# EAGLE design YOTSUBA_MC_ver.2.3 (EAGLE 9.6.2)
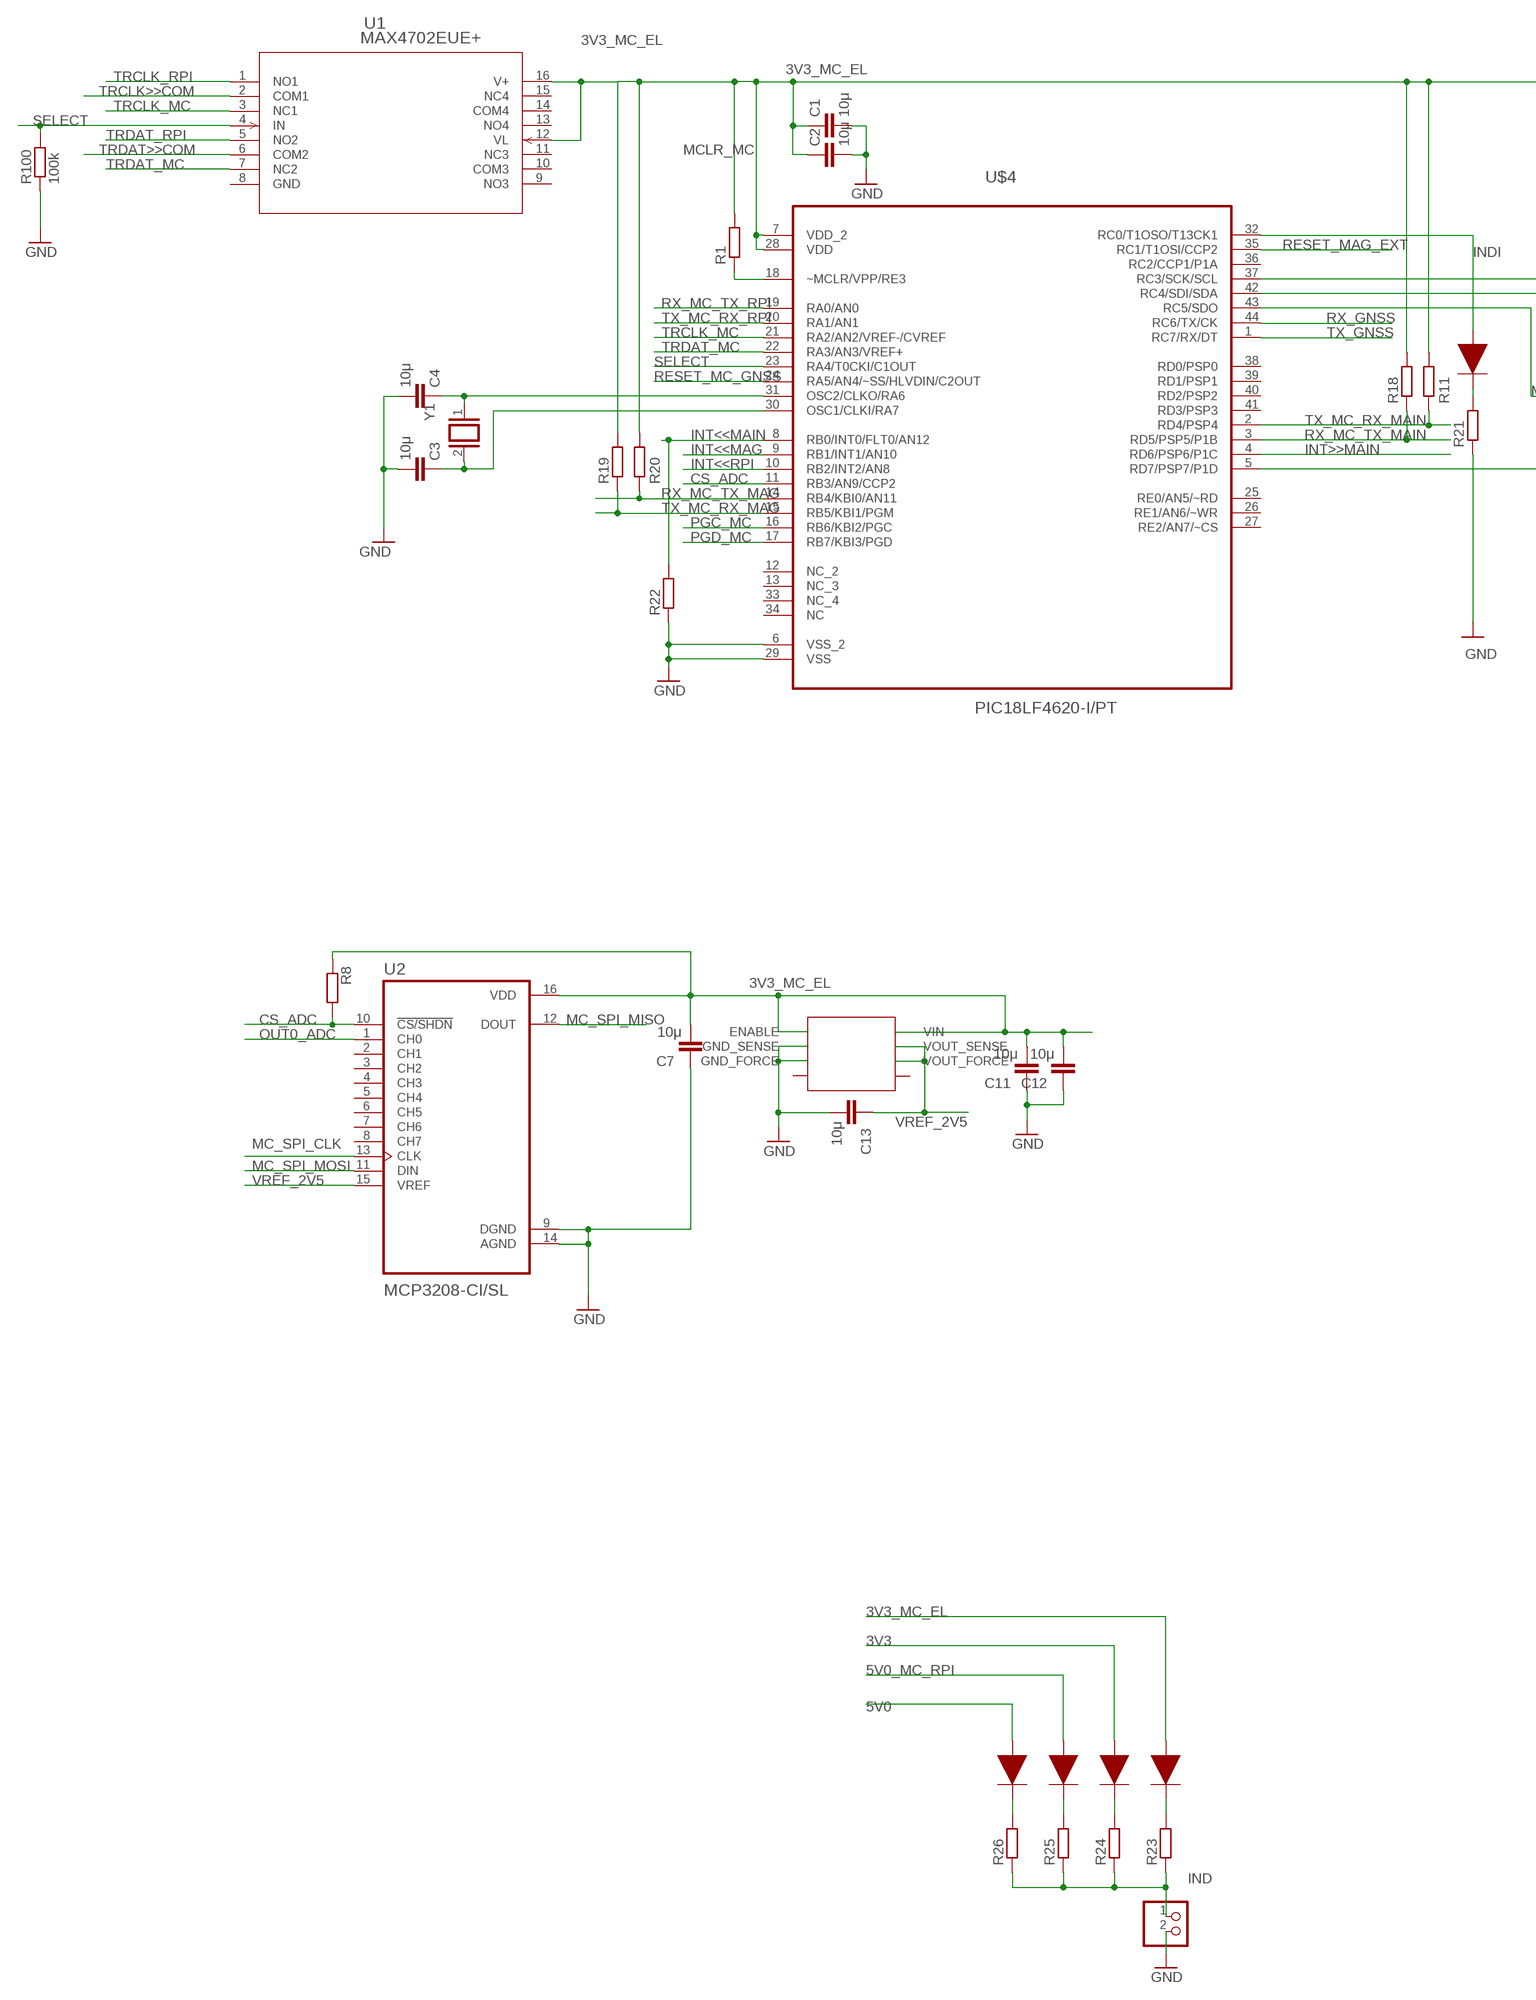
[diagram p0: schematic, sheet 1, part 1 of 2]
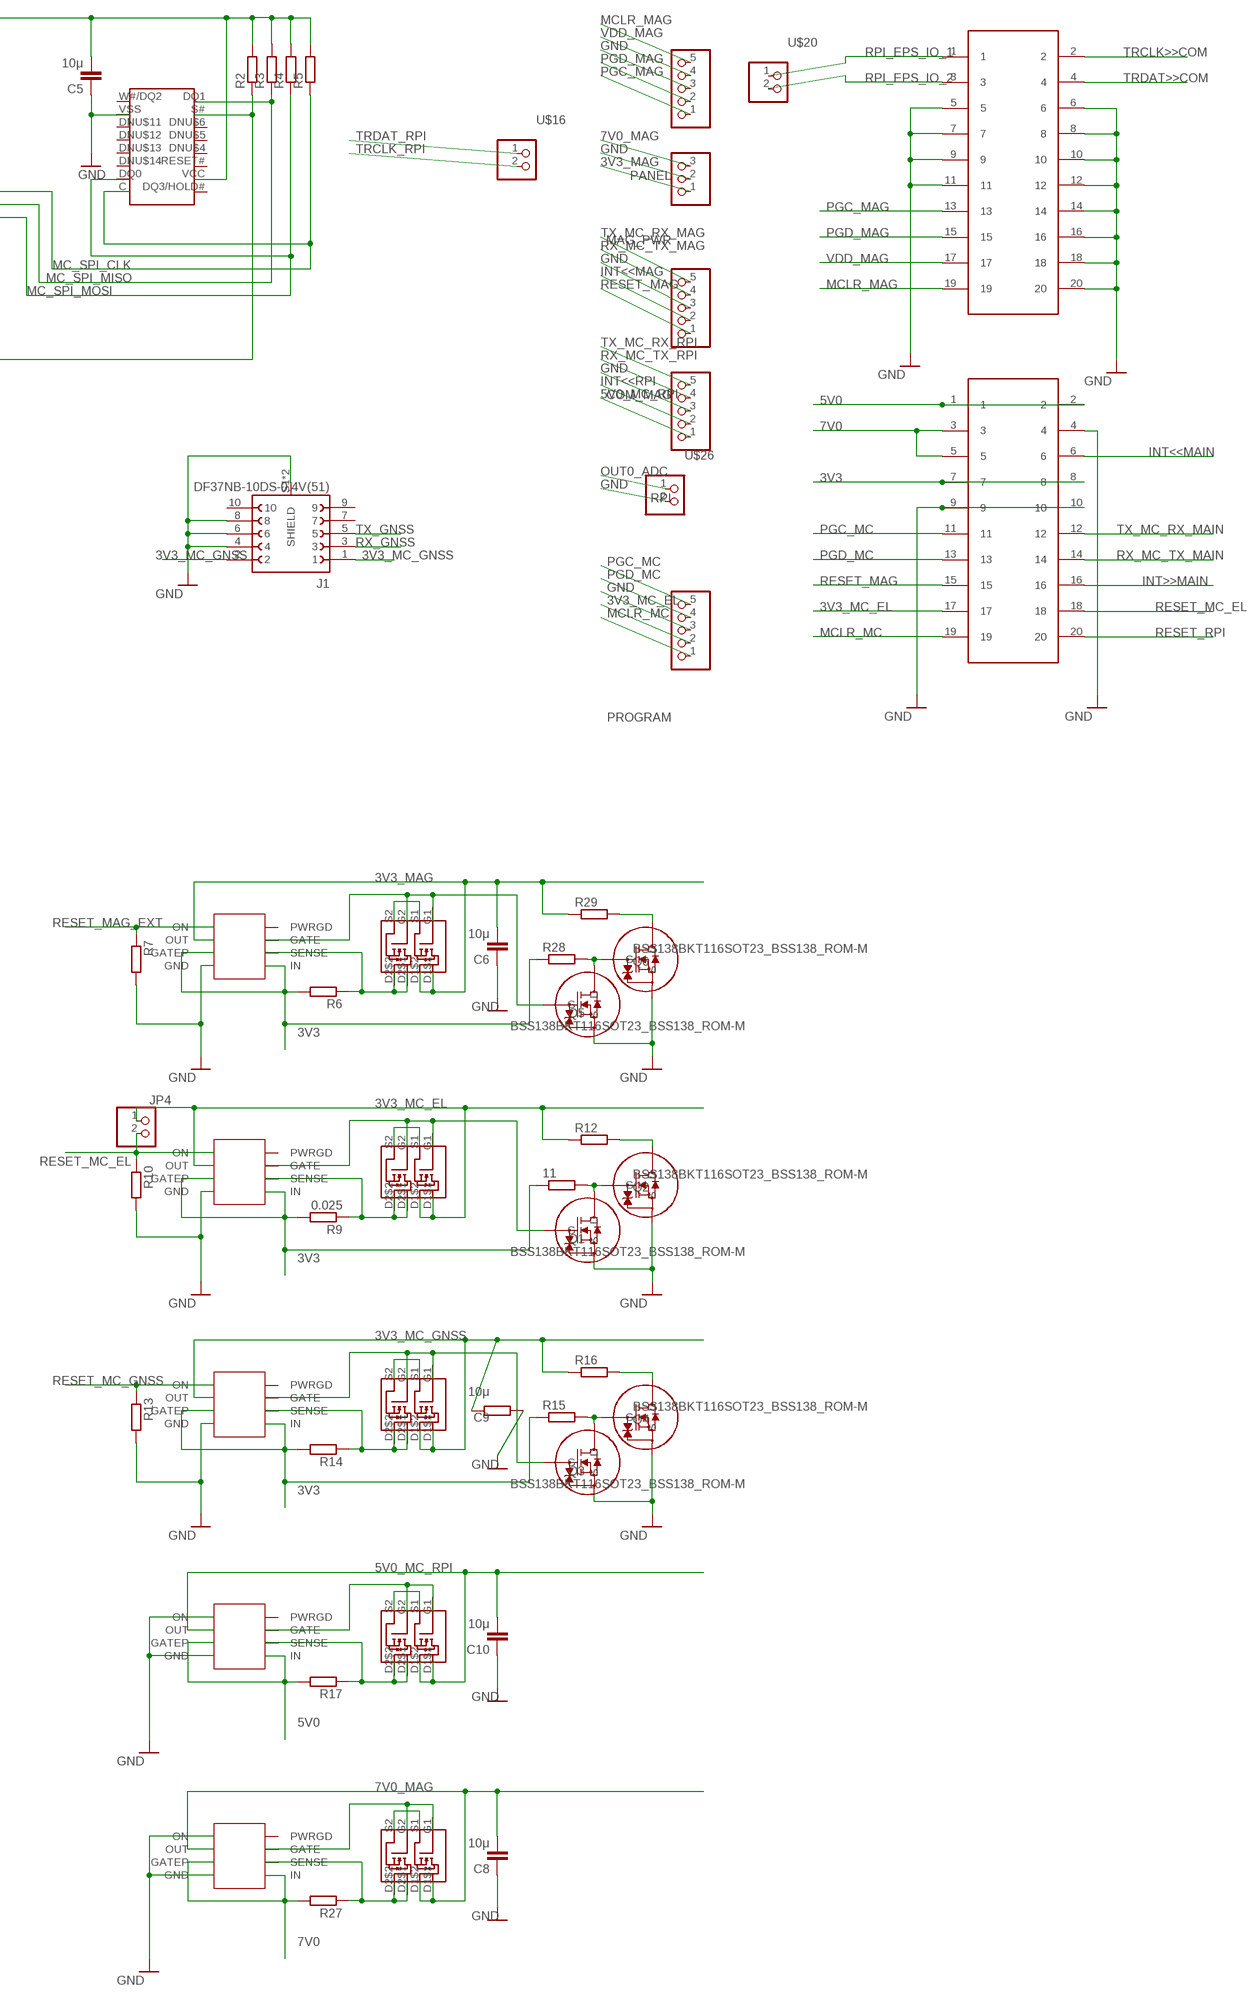
[diagram p1: schematic, sheet 1, part 2 of 2]

## Parts
11  R-EU_R2012  [R2012]
C1  10μ  C-EUC2012  [C2012]
C2  10μ  C-EUC2012  [C2012]
C3  10μ  C-EUC2012  [C2012]
C4  10μ  C-EUC2012  [C2012]
C5  10μ  C-EUC2012  [C2012]
C6  10μ  C-EUC2012  [C2012]
C7  10μ  C-EUC2012  [C2012]
C8  10μ  C-EUC2012  [C2012]
C9  10μ  R-EU_R2012  [R2012]
C10  10μ  C-EUC2012  [C2012]
C11  10μ  C-EUC2012  [C2012]
C12  10μ  C-EUC2012  [C2012]
C13  10μ  C-EUC2012  [C2012]
COM_MAG  PINHD-1X5  [1X05]
IND  PINHD-1X2  [1X02]
J1  DF37NB-10DS-0.4V(51)  [HRS_DF37NB-10DS-0.4V(51)]
JP4  PINHD-1X2  [1X02]
MAG_PWR  PINHD-1X3  [1X03]
PANEL  PINHD-1X5  [1X05]
PROGRAM  PINHD-1X5  [1X05]
Q1  BSS138BKT116SOT23_BSS138_ROM-M  [SOT23_BSS138_ROM-M]
Q2  BSS138BKT116SOT23_BSS138_ROM-M  [SOT23_BSS138_ROM-M]
Q3  BSS138BKT116SOT23_BSS138_ROM-M  [SOT23_BSS138_ROM-M]
Q4  BSS138BKT116SOT23_BSS138_ROM-M  [SOT23_BSS138_ROM-M]
Q5  BSS138BKT116SOT23_BSS138_ROM-M  [SOT23_BSS138_ROM-M]
Q6  BSS138BKT116SOT23_BSS138_ROM-M  [SOT23_BSS138_ROM-M]
R1  R-EU_R2012  [R2012]
R2  R-EU_R2012  [R2012]
R3  R-EU_R2012  [R2012]
R4  R-EU_R2012  [R2012]
R5  R-EU_R2012  [R2012]
R6  R-EU_R2012  [R2012]
R7  R-EU_R2012  [R2012]
R8  R-EU_R2012  [R2012]
R9  0.025  R-EU_R2012  [R2012]
R10  R-EU_R2012  [R2012]
R11  R-EU_R2012  [R2012]
R12  R-EU_R2012  [R2012]
R13  R-EU_R2012  [R2012]
R14  R-EU_R2012  [R2012]
R15  R-EU_R2012  [R2012]
R16  R-EU_R2012  [R2012]
R17  R-EU_R2012  [R2012]
R18  R-EU_R2012  [R2012]
R19  R-EU_R2012  [R2012]
R20  R-EU_R2012  [R2012]
R21  R-EU_R2012  [R2012]
R22  R-EU_R2012  [R2012]
R23  R-EU_R2012  [R2012]
R24  R-EU_R2012  [R2012]
R25  R-EU_R2012  [R2012]
R26  R-EU_R2012  [R2012]
R27  R-EU_R2012  [R2012]
R28  R-EU_R2012  [R2012]
R29  R-EU_R2012  [R2012]
R100  100k  R-EU_R2012  [R2012]
RPI  PINHD-1X5  [1X05]
U1  MAX4702EUE+  [21-0066J_16]
U2  MCP3208-CI/SL  [SOIC127P600X175-16N]
U$1  MT25QL512_16SOP2  [SOIC127P1032X265-16N]
U$2  DMG6898LSD  [SOIC127P600X150-8N]
U$3  LTC4361  [SOP65P280X100-8N]
U$4  PIC18LF4620-I/PT  [QFP80P1200X1200X120-44N]
U$7  DMG6898LSD  [SOIC127P600X150-8N]
U$8  LTC4361  [SOP65P280X100-8N]
U$9  DMG6898LSD  [SOIC127P600X150-8N]
U$10  DMG6898LSD  [SOIC127P600X150-8N]
U$11  LTC4361  [SOP65P280X100-8N]
U$12  LTC4361  [SOP65P280X100-8N]
U$13  DMG6898LSD  [SOIC127P600X150-8N]
U$14  LTC4361  [SOP65P280X100-8N]
U$16  PINHD-1X2  [1X02]
U$17  M50-3001045  [M50-3001045]
U$18  LED_1608  [LED_1608]
U$19  ADR35XX  [SOP65P490X110-8N]
U$20  PINHD-1X2  [1X02]
U$21  LED_1608  [LED_1608]
U$22  M50-3001045  [M50-3001045]
U$23  LED_1608  [LED_1608]
U$24  LED_1608  [LED_1608]
U$25  LED_1608  [LED_1608]
U$26  PINHD-1X2  [1X02]
Y1  HC-49/U-S16000000ABJB  [XTAL_HC49P488W43L1150T466H350]

## Nets
3V3 [POWER]: 11.1 R6.2 R9.2 R14.2 R15.1 R28.1 U$3.GATEP U$3.IN U$8.GATEP U$8.IN U$11.GATEP U$11.IN U$17.7 U$17.8 U$23.A
3V3_MAG [POWER]: C6.2 MAG_PWR.1 R29.1 U$2.D1$1 U$2.D1$2 U$3.OUT
3V3_MC_EL [POWER]: C1.1 C2.1 C5.2 C7.2 C11.2 C12.2 JP4.1 PROGRAM.2 R1.2 R2.2 R3.2 R4.2 R5.2 R8.1 R11.2 R12.1 R18.2 R19.2 R20.2 U1.12(VL) U1.16(V+) U2.16(VDD) U$1.VCC U$4.7(VDD_2) U$4.28(VDD) U$7.D1$1 U$7.D1$2 U$8.OUT U$17.17 U$19.ENABLE U$19.VIN U$21.A
3V3_MC_GNSS [POWER]: C9.2 J1.1 J1.2 R16.1 U$10.D1$1 U$10.D1$2 U$11.OUT
5V0 [POWER]: R17.2 U$14.GATEP U$14.IN U$17.1 U$17.2 U$25.A
5V0_MC_RPI [POWER]: C10.2 RPI.1 U$13.D1$1 U$13.D1$2 U$14.OUT U$24.A
7V0 [POWER]: R27.2 U$12.GATEP U$12.IN U$17.3 U$17.5
7V0_MAG [POWER]: C8.2 MAG_PWR.3 U$9.D1$1 U$9.D1$2 U$12.OUT
CS_ADC: R8.2 U2.10(!CS/SHDN) U$4.11(RB3/AN9/CCP2)
GND [gnd]: C1.2 C2.2 C3.2 C4.2 C5.1 C6.1 C7.1 C8.1 C9.1 C10.1 C11.1 C12.1 C13.2 COM_MAG.3 IND.2 J1.4 J1.6 J1.8 J1.S1(SHIELD) J1.S2(SHIELD) MAG_PWR.2 PANEL.3 PROGRAM.3 Q1.1(S) Q2.1(S) Q3.1(S) Q4.1(S) Q5.1(S) Q6.1(S) R7.2 R10.2 R13.2 R21.1 R22.1 R100.1 RPI.3 U2.9(DGND) U2.14(AGND) U$1.VSS U$3.GND U$4.6(VSS_2) U$4.29(VSS) U$8.GND U$11.GND U$12.GND U$12.ON U$14.GND U$14.ON U$17.4 U$17.9 U$17.10 U$19.GND_FORCE U$19.GND_SENSE U$22.5 U$22.6 U$22.7 U$22.8 U$22.9 U$22.10 U$22.11 U$22.12 U$22.14 U$22.16 U$22.18 U$22.20 U$26.2
INDI: U$4.32(RC0/T1OSO/T13CK1) U$18.A
INT<<MAG: COM_MAG.2 U$4.9(RB1/INT1/AN10)
INT<<MAIN: R22.2 U$4.8(RB0/INT0/FLT0/AN12) U$17.6
INT<<RPI: RPI.2 U$4.10(RB2/INT2/AN8)
INT>>MAIN: U$4.4(RD6/PSP6/P1C) U$17.16
MC_SPI_CLK: R5.1 U2.13(CLK) U$1.C U$4.37(RC3/SCK/SCL)
MC_SPI_MISO: R3.1 U2.12(DOUT) U$1.DQ1 U$4.42(RC4/SDI/SDA)
MC_SPI_MOSI: R4.1 U2.11(DIN) U$1.DQ0 U$4.43(RC5/SDO)
MCLR_MAG: PANEL.5 U$22.19
MCLR_MC: PROGRAM.1 R1.1 U$4.18(~MCLR/VPP/RE3) U$17.19
N$2: R23.2 U$21.C
N$3: C3.1 U$4.30(OSC1/CLKI/RA7) Y1.2
N$4: R24.2 U$23.C
N$5: C4.1 U$4.31(OSC2/CLKO/RA6) Y1.1
N$6: R25.2 U$24.C
N$7: R26.2 U$25.C
N$8: R2.1 U$1.S# U$4.5(RD7/PSP7/P1D)
N$9: IND.1 R23.1 R24.1 R25.1 R26.1
N$10: U$2.S1 U$2.S2
N$11: R6.1 U$2.D2$1 U$2.D2$2 U$3.SENSE
N$12: Q5.2(G) U$2.G1 U$2.G2 U$3.GATE
N$13: Q5.3(D) Q6.2(G) R28.2
N$14: U$9.S1 U$9.S2
N$15: R21.2 U$18.C
N$16: R27.1 U$9.D2$1 U$9.D2$2 U$12.SENSE
N$17: U$9.G1 U$9.G2 U$12.GATE
N$18: Q6.3(D) R29.2
N$19: U$7.S1 U$7.S2
N$20: R9.1 U$7.D2$1 U$7.D2$2 U$8.SENSE
N$22: Q1.2(G) U$7.G1 U$7.G2 U$8.GATE
N$24: 11.2 Q1.3(D) Q2.2(G)
N$26: Q2.3(D) R12.2
N$28: U$10.S1 U$10.S2
N$29: R14.1 U$10.D2$1 U$10.D2$2 U$11.SENSE
N$30: Q3.2(G) U$10.G1 U$10.G2 U$11.GATE
N$33: Q3.3(D) Q4.2(G) R15.2
N$34: Q4.3(D) R16.2
N$36: U$13.S1 U$13.S2
N$37: R17.1 U$13.D2$1 U$13.D2$2 U$14.SENSE
N$38: U$13.G1 U$13.G2 U$14.GATE
OUT0_ADC: U2.1(CH0) U$26.1
PGC_MAG: PANEL.1 U$22.13
PGC_MC: PROGRAM.5 U$4.16(RB6/KBI2/PGC) U$17.11
PGD_MAG: PANEL.2 U$22.15
PGD_MC: PROGRAM.4 U$4.17(RB7/KBI3/PGD) U$17.13
RESET_MAG: COM_MAG.1 U$17.15
RESET_MAG_EXT: R7.1 U$3.ON U$4.35(RC1/T1OSI/CCP2)
RESET_MC_EL: JP4.2 R10.1 U$8.ON U$17.18
RESET_MC_GNSS: R13.1 U$4.24(RA5/AN4/~SS/HLVDIN/C2OUT) U$11.ON
RESET_RPI: U$17.20
RPI_EPS_IO_1: U$20.1 U$22.1
RPI_EPS_IO_2: U$20.2 U$22.3
RX_GNSS: J1.3 U$4.44(RC6/TX/CK)
RX_MC_TX_MAG: COM_MAG.4 R20.1 U$4.14(RB4/KBI0/AN11)
RX_MC_TX_MAIN: R18.1 U$4.3(RD5/PSP5/P1B) U$17.14
RX_MC_TX_RPI: RPI.4 U$4.19(RA0/AN0)
SELECT: R100.2 U1.4(IN) U$4.23(RA4/T0CKI/C1OUT)
TRCLK>>COM: U1.2(COM1) U$22.2
TRCLK_MC: U1.3(NC1) U$4.21(RA2/AN2/VREF-/CVREF)
TRCLK_RPI: U1.1(NO1) U$16.1
TRDAT>>COM: U1.6(COM2) U$22.4
TRDAT_MC: U1.7(NC2) U$4.22(RA3/AN3/VREF+)
TRDAT_RPI: U1.5(NO2) U$16.2
TX_GNSS: J1.5 U$4.1(RC7/RX/DT)
TX_MC_RX_MAG: COM_MAG.5 R19.1 U$4.15(RB5/KBI1/PGM)
TX_MC_RX_MAIN: R11.1 U$4.2(RD4/PSP4) U$17.12
TX_MC_RX_RPI: RPI.5 U$4.20(RA1/AN1)
VDD_MAG: PANEL.4 U$22.17
VREF_2V5: C13.1 U2.15(VREF) U$19.VOUT_FORCE U$19.VOUT_SENSE
Unconnected: J1.7 J1.9 J1.10 U1.9(NO3) U1.10(COM3) U1.11(NC3) U1.13(NO4) U1.14(COM4) U1.15(NC4) U2.2(CH1) U2.3(CH2) U2.4(CH3) U2.5(CH4) U2.6(CH5) U2.7(CH6) U2.8(CH7) U$1.DNU$4 U$1.DNU$5 U$1.DNU$6 U$1.DNU$11 U$1.DNU$12 U$1.DNU$13 U$1.DNU$14 U$1.DQ3/HOLD# U$1.RESET# U$1.W#/DQ2 U$3.PWRGD U$4.12(NC_2) U$4.13(NC_3) U$4.25(RE0/AN5/~RD) U$4.26(RE1/AN6/~WR) U$4.27(RE2/AN7/~CS) U$4.33(NC_4) U$4.34(NC) U$4.36(RC2/CCP1/P1A) U$4.38(RD0/PSP0) U$4.39(RD1/PSP1) U$4.40(RD2/PSP2) U$4.41(RD3/PSP3) U$8.PWRGD U$11.PWRGD U$12.PWRGD U$14.PWRGD U$19.NIC@1(NIC) U$19.NIC@2(NIC)

## Power pins joined to a net without a drawn wire
GND: U1.8(GND)

## Library data of the parts
11 C9 R1-R29 R100 = rcl:R-EU_: RESISTOR, European symbol; SPICEPREFIX: R
C1-C8 C10-C13 = rcl:C-EU: CAPACITOR, European symbol; SPICEPREFIX: C
COM_MAG PANEL PROGRAM RPI = pinhead:PINHD-1X5: PIN HEADER
IND JP4 U$16 U$20 U$26 = pinhead:PINHD-1X2: PIN HEADER
J1 = DF37NB-10DS-0.4V_51_:DF37NB-10DS-0.4V(51): Check availability <https://pricing.snapeda.com/parts/DF37NB-10DS-0.4V%2851%29/Hirose/view-part?ref=eda>; AVAILABILITY: In Stock; DESCRIPTION: 10 Position Connector Receptacle, Center Strip Contacts Surface Mount Gold; MF: Hirose; MP: DF37NB-10DS-0.4V(51); PACKAGE: None; PRICE: None; PURCHASE-URL: https://pricing.snapeda.com/search?q=DF37NB-10DS-0.4V(51)&ref=eda
MAG_PWR = pinhead:PINHD-1X3: PIN HEADER
Q1-Q6 = BSS138BKT:BSS138BKT116; COPYRIGHT: Copyright (C) 2023 Ultra Librarian. All rights reserved.; DIGIKEY_PART_NUMBER_1: 846-BSS138BKT116TR-ND; DIGIKEY_PART_NUMBER_2: 846-BSS138BKT116CT-ND; DIGIKEY_PART_NUMBER_3: 846-BSS138BKT116DKR-ND; MANUFACTURER_PART_NUMBER: BSS138BKT116; MFR_NAME: ROHM Semiconductor
U1 = MAX4702:MAX4702EUE+; COPYRIGHT: Copyright (C) 2022 Ultra Librarian. All rights reserved.; MANUFACTURER_PART_NUMBER: MAX4702EUE+; MFR_NAME: Analog Devices Inc
U2 = MCP3208-CI_SL:MCP3208-CI/SL: Check availability <https://pricing.snapeda.com/parts/MCP3208-CI/SL/Microchip%20Technology/view-part?ref=eda>; AVAILABILITY: In Stock; DESCRIPTION: 12 Bit Analog to Digital Converter 4, 8 Input 1 SAR 16-SOIC; MF: Microchip Technology; MP: MCP3208-CI/SL; PACKAGE: SOIC-16 Microchip; PRICE: None; PURCHASE-URL: https://pricing.snapeda.com/search?q=MCP3208-CI/SL&ref=eda
U$1 = MT25QL512_8:MT25QL512_16SOP2
U$2 U$7 U$9 U$10 U$13 = DMG6898LSD:DMG6898LSD
U$3 U$8 U$11 U$12 U$14 = ltc4361:LTC4361
U$4 = PIC18LF4620-I_PT:PIC18LF4620-I/PT: Flash Microcontrollers Check availability <https://pricing.snapeda.com/parts/PIC18LF4620-I/PT/Microchip/view-part?ref=eda>; AVAILABILITY: In Stock; DESCRIPTION: PIC PIC® 18F Microcontroller IC 8-Bit 40MHz 64KB (32K x 16) FLASH 44-TQFP (10x10); MF: Microchip; MP: PIC18LF4620-I/PT; PACKAGE: TQFP-44 Microchip; PRICE: None; PURCHASE-URL: https://pricing.snapeda.com/search?q=PIC18LF4620-I/PT&ref=eda
U$17 U$22 = MITSUBA_Connectors-v4.0:M50-3001045: 20pins 1.27mm pitch 2line pinsocket
U$18 U$21 U$23-U$25 = LED_1608:LED_1608
U$19 = adr35xx:ADR35XX
Y1 = HC-49_U-S16000000ABJB:HC-49/U-S16000000ABJB: HC49US Series 16 MHz ±30 ppm 18 pF -20 to +70 °C Through Hole AT-CUT Crystal; DESCRIPTION: 16 MHz ±30ppm Crystal 18pF 50 Ohms HC-49/US; DIGI-KEY_PART_NUMBER: 300-6034-ND; MF: Citizen Finedevice Co Ltd; MP: HC-49/U-S16000000ABJB; PACKAGE: HC-49/US Citizen Finetech Miyota; PURCHASE-URL: https://pricing.snapeda.com/search?q=HC-49/U-S16000000ABJB&ref=eda

## Net classes
0 default: clearance 0.178 mm
1 ant: clearance 0.559 mm
2 gnd: clearance 0.508 mm
3 POWER: width 0.305 mm, clearance 0.254 mm

## Board
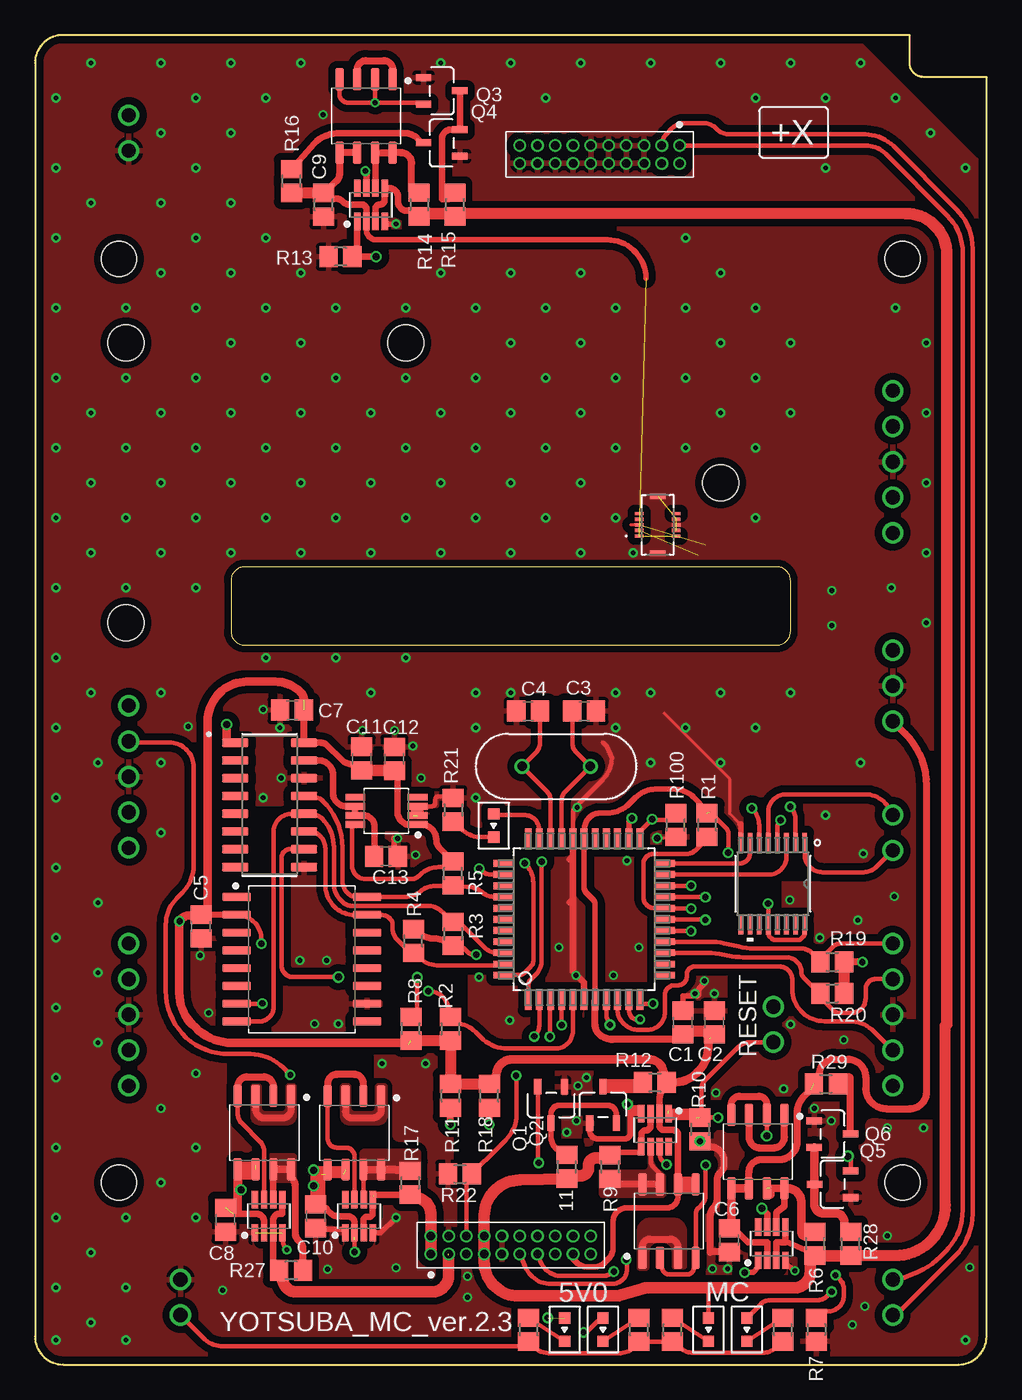
[diagram p2: board, top side]
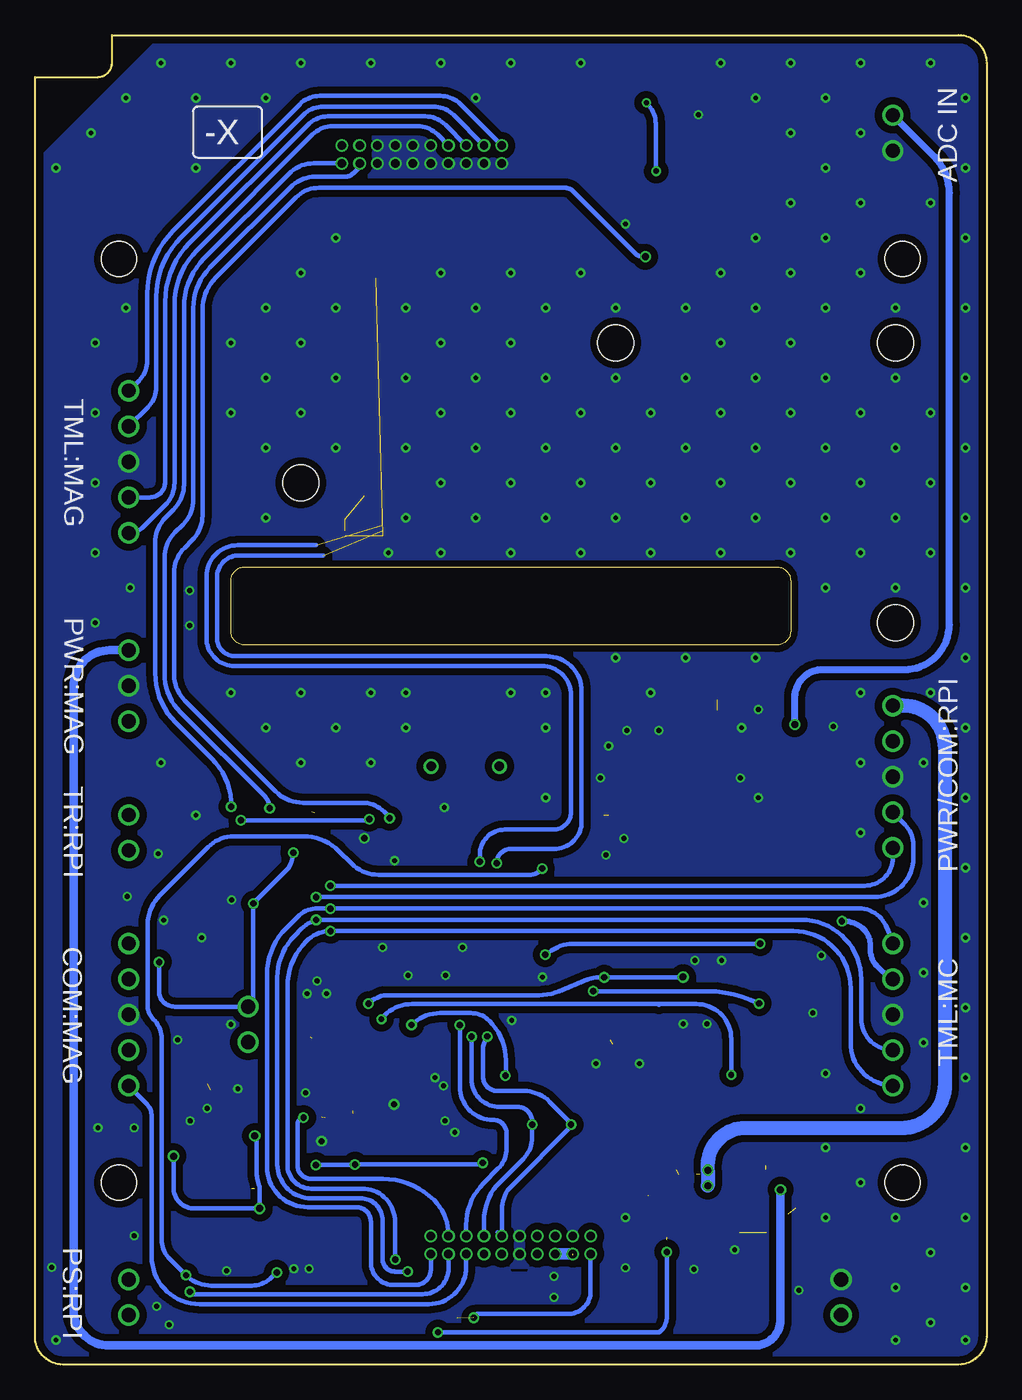
[diagram p3: board, bottom side, seen from below]

Size 68 x 95 mm. Coordinates in mm from the lower left corner, seen from the top.
Outline: 0,93 0,2 arc90 2,0 66,0 arc90 68,2 68,92 63.5,92 arc-90 62.5,93 62.5,95 2,95 arc90 0,93
Outline: 14,56 14,52.4 arc90 15,51.4 53,51.4 arc90 54,52.4 54,56 arc90 53,57 15,57 arc90 14,56
Copper layers (1*16): Top 0.035mm / dielectric 1.6mm / Bottom 0.035mm
Design rules "Elecrow_2-layer_PCB_eagle_rule": minimum track width 6mil, minimum drill 12mil, track to track 6mil, track to pad 6mil, pad to pad 6mil, via to via 8mil, smd to smd 0mil, copper to edge 20mil, drill to drill 10mil, minimum pad ring 6mil, minimum via ring 6mil, stop-mask expansion 0mil, vias tented up to drill 100mil, thermal gap 10mil
Holes 2.5 mm at 6,13 62,13 62,79 6,79
Holes 2.6 mm at 6.5,73 6.5,53 49,63 26.5,73
tRestrict: area 25,23.7 to 25.7,27.1; area 35.1,19 to 37,21; area 34.9,19 to 35.4,20; area 40.2,15.8 to 42.6,16.6; area 41.4,18.6 to 43.1,19.2; area 24.3,43.8 to 24.7,44.1; area 15,33.9 to 16.7,34.2; area 25.1,38.1 to 25.7,38.4; area 50.7,38.3 to 51,39; area 28.2,39.1 to 28.9,39.7; 30 lines
bRestrict: area 32.9,6.8 to 33.9,6.8; area 6.4,24.7 to 6.9,25

### Footprints (pad centres in the part's own frame; a part is rotated, then mirrored left to right if it is on the bottom)
R2012 = smd 1.3 x 1.5: 1 -0.85,0; 2 0.85,0
C2012 = smd 1.3 x 1.5: 1 -0.85,0; 2 0.85,0
1X05 = drill 1.016: 1 -5.08,0; 2 -2.54,0; 3 0,0; 4 2.54,0; 5 5.08,0
1X02 = drill 1.016: 1 -1.27,0; 2 1.27,0
HRS_DF37NB-10DS-0.4V(51) = smd 0.23 x 0.63: 1 0.8,-1.325; 2 0.8,1.325; 3 0.4,-1.325; 4 0.4,1.325; 5 0,-1.325; 6 0,1.325; 7 -0.4,-1.325; 8 -0.4,1.325; 9 -0.8,-1.325; 10 -0.8,1.325 | smd 0.38 x 1.1: S1 2.04,0; S2 -2.04,0
1X03 = drill 1.016: 1 -2.54,0; 2 0,0; 3 2.54,0
SOT23_BSS138_ROM-M = smd 1.105 x 0.508: 1 -1.302,0.95; 2 -1.302,-0.95; 3 1.302,0
21-0066J_16 = smd 1.379 x 0.34: 1 -2.937,2.275; 2 -2.937,1.625; 3 -2.937,0.975; 5 -2.937,-0.325; 6 -2.937,-0.975; 7 -2.937,-1.625; 8 -2.937,-2.275; 9 2.937,-2.275; 10 2.937,-1.625; 11 2.937,-0.975; 12 2.937,-0.325; 13 2.937,0.325; 14 2.937,0.975; 15 2.937,1.625; 16 2.937,2.275 | smd 1.379 x 0.3: 4 -2.937,0.325
SOIC127P600X175-16N = smd 1.9 x 0.6: 1 -2.455,4.445; 2 -2.455,3.175; 3 -2.455,1.905; 4 -2.455,0.635; 5 -2.455,-0.635; 6 -2.455,-1.905; 7 -2.455,-3.175; 8 -2.455,-4.445; 9 2.455,-4.445; 10 2.455,-3.175; 11 2.455,-1.905; 12 2.455,-0.635; 13 2.455,0.635; 14 2.455,1.905; 15 2.455,3.175; 16 2.455,4.445
SOIC127P1032X265-16N = smd 2.052 x 0.602: C 4.654,4.445; DNU$4 -4.654,0.635; DNU$5 -4.654,-0.635; DNU$6 -4.654,-1.905; DNU$11 4.654,-1.905; DNU$12 4.654,-0.635; DNU$13 4.654,0.635; DNU$14 4.654,1.905; DQ0 4.654,3.175; DQ1 -4.654,-4.445; DQ3/HOLD# -4.654,4.445; RESET# -4.654,1.905; S# -4.654,-3.175; VCC -4.654,3.175; VSS 4.654,-3.175; W#/DQ2 4.654,-4.445
SOIC127P600X150-8N = smd 1.58 x 0.589: D1$1 -2.625,1.905; D1$2 -2.625,0.635; D2$1 -2.625,-0.635; D2$2 -2.625,-1.905; G1 2.625,1.905; G2 2.625,-0.635; S1 2.625,0.635; S2 2.625,-1.905
SOP65P280X100-8N = smd 1.237 x 0.459: GATE 1.187,0.325; GATEP -1.187,-0.325; GND -1.187,-0.975; IN 1.187,-0.975; ON -1.187,0.975; OUT -1.187,0.325; PWRGD 1.187,0.975; SENSE 1.187,-0.325
QFP80P1200X1200X120-44N = smd 1.473 x 0.483: 1 -5.74,3.988; 2 -5.74,3.2; 3 -5.74,2.388; 4 -5.74,1.6; 5 -5.74,0.787; 6 -5.74,0; 7 -5.74,-0.787; 8 -5.74,-1.6; 9 -5.74,-2.388; 10 -5.74,-3.2; 11 -5.74,-3.988; 23 5.74,-3.988; 24 5.74,-3.2; 25 5.74,-2.388; 26 5.74,-1.6; 27 5.74,-0.787; 28 5.74,0; 29 5.74,0.787; 30 5.74,1.6; 31 5.74,2.388; 32 5.74,3.2; 33 5.74,3.988 | smd 0.483 x 1.473: 12 -3.988,-5.74; 13 -3.2,-5.74; 14 -2.388,-5.74; 15 -1.6,-5.74; 16 -0.787,-5.74; 17 0,-5.74; 18 0.787,-5.74; 19 1.6,-5.74; 20 2.388,-5.74; 21 3.2,-5.74; 22 3.988,-5.74; 34 3.988,5.74; 35 3.2,5.74; 36 2.388,5.74; 37 1.6,5.74; 38 0.787,5.74; 39 0,5.74; 40 -0.787,5.74; 41 -1.6,5.74; 42 -2.388,5.74; 43 -3.2,5.74; 44 -3.988,5.74
M50-3001045 = drill 0.6: 1 0,0; 2 0,1.27; 3 1.27,0; 4 1.27,1.27; 5 2.54,0; 6 2.54,1.27; 7 3.81,0; 8 3.81,1.27; 9 5.08,0; 10 5.08,1.27; 11 6.35,0; 12 6.35,1.27; 13 7.62,0; 14 7.62,1.27; 15 8.89,0; 16 8.89,1.27; 17 10.16,0; 18 10.16,1.27; 19 11.43,0; 20 11.43,1.27
LED_1608 = smd 0.8 x 0.8: A 0.4,0.4; C 2.05,0.4
SOP65P490X110-8N = smd 1.424 x 0.497: ENABLE -2.219,0.975; GND_FORCE -2.219,-0.325; GND_SENSE -2.219,0.325; NIC@1 -2.219,-0.975; NIC@2 2.219,-0.975; VIN 2.219,0.975; VOUT_FORCE 2.219,-0.325; VOUT_SENSE 2.219,0.325
XTAL_HC49P488W43L1150T466H350 = drill 0.68 pad 1.08: 1 -2.44,0; 2 2.44,0

### Placement (x,y rotation side)
11  38.02,14.13 90 top
C1  46.3,24.43 90 top
C2  48.54,24.43 90 top
C3  39.24,46.69 0 top
C4  35.24,46.69 180 top
C5  11.87,31.29 90 top
C6  49.61,8.89 90 top
C7  18.37,46.76 0 top
C8  13.61,10.34 90 top
C9  20.62,82.87 90 top
C10  20.07,10.6 90 top
C11  23.35,43.29 270 top
C12  25.69,43.28 270 top
C13  25.08,36.32 0 top
COM_MAG  61.3,25 90 top
IND  10.4,4.8 90 top
J1  44.5,60 270 top
JP4  52.77,24.3 270 top
MAG_PWR  61.3,48.5 90 top
PANEL  61.3,64.5 90 top
PROGRAM  6.7,25 270 top
Q1  36.88,18.54 270 top
Q2  40.59,18.55 90 top
Q3  29.07,91.01 0 top
Q4  29.07,87.29 180 top
Q5  57,12.88 180 top
Q6  56.99,16.47 0 top
R1  48.03,38.55 90 top
R2  29.68,23.99 270 top
R3  29.87,30.78 270 top
R4  27.04,30.26 90 top
R5  29.88,35.09 90 top
R6  55.74,8.64 270 top
R7  55.84,2.5 270 top
R8  26.86,24 90 top
R9  41.1,14.11 90 top
R10  47.52,16.8 270 top
R11  29.69,19.2 90 top
R12  44.29,20.15 180 top
R13  21.83,79.16 180 top
R14  27.46,82.88 270 top
R15  30.01,82.88 90 top
R16  18.33,84.57 90 top
R17  26.81,12.99 270 top
R18  32.47,19.2 90 top
R19  56.97,28.77 0 top
R20  56.97,26.52 0 top
R21  29.89,39.63 270 top
R22  30.36,13.63 0 top
R23  53.44,2.49 90 top
R24  45.56,2.49 90 top
R25  43.16,2.49 90 top
R26  35.28,2.49 90 top
R27  18.3,6.74 180 top
R28  58.29,8.64 90 top
R29  56.52,20.05 0 top
R100  45.79,38.54 90 top
RPI  6.7,42 270 top
U1  52.73,34.36 270 top
U2  16.77,39.99 0 top
U$1  19.07,28.96 0 top
U$2  51.66,15.22 90 top
U$3  52.65,8.64 90 top
U$4  39.24,31.81 90 top
U$7  45.31,10.24 270 top
U$8  44.31,16.75 270 top
U$9  16.4,16.58 90 top
U$10  23.66,89.21 90 top
U$11  24.01,82.87 90 top
U$12  16.7,10.6 90 top
U$13  22.83,16.55 90 top
U$14  23.16,10.6 90 top
U$16  61.3,38 90 top
U$17  28.29,7.9 0 top
U$18  32.38,39.73 270 top
U$19  25.11,39.56 180 top
U$20  61.3,4.8 270 top
U$21  50.47,3.71 270 top
U$22  46.07,87.1 180 top
U$23  47.73,3.71 270 top
U$24  40.19,3.71 270 top
U$25  37.45,3.71 270 top
U$26  6.7,88 270 top
Y1  37.24,42.74 0 top

### Tracks (layer width: path | path; a pad name or v marks a point on that pad's centre or on a via)
3V3
  Top 0.305: 40.66,14.76 41.07,15.17 | 41.21,15.17 R9.2 41.26,15.06 | 43.34,15.44 U$8.IN 43.34,15.48 arc-90 43.3,15.44 | 56.29,7.78 R6.2 | U$23.A 48.13,5.44 48.1,5.47
  Top 0.406: 41.3,15.16 43.3,15.16 43.3,15.44
  Top 0.45: U$8.GATEP 43.98,17.05 arc-90 43.67,16.73 43.65,16.73 arc90 43.33,16.41 43.33,15.44 43.34,15.44 | 41.21,15.17 41.07,15.17 | U$11.GATEP 24.34,82.57 arc-90 24.66,82.89 24.67,82.89 arc90 24.98,83.2 U$11.IN 25.32,84.06 arc-90 25.95,83.42 25.95,83.08 arc90 26.59,82.44 26.92,82.44 R14.2 | U$3.GATEP 52.98,8.73 53.62,8.73 53.62,8.8 | 53.62,8.8 U$3.IN | 53.62,8.8 55.6,7.93 R6.2
  Top 0.8: R28.1 61.48,7.79 arc90 65.07,11.38 65.07,24.19 | 62.23,82.24 30.22,82.24 R15.1
  Top 0.813: 62.23,82.24 arc-90 65.17,79.3 65.17,24.29 65.07,24.19 | 40.66,14.76 40.1,14.76 arc90 39.56,14.22 39.56,14.06 arc-90 38.98,13.48 38.22,13.48 11.1 34.65,13.18 arc90 32.1,10.63 U$17.8 U$17.7 32.1,7.35 arc90 34.55,4.9 41.51,4.9 arc17 41.8,4.94 43.41,5.43 arc-17 43.7,5.47 48.1,5.47 54.23,5.47 arc90 55.41,6.65 55.41,7.46 R6.2 R28.1 58.58,7.69 | R9.2 41.3,15.16 | R14.2 27.67,82.24 29.8,82.24 R15.1
  Bottom 0.305: U$17.8 32.1,9.31
3V3_MAG  (1 unrouted)
  Top 0.45: U$3.OUT 52.33,8.72 50.95,8.72 49.93,9.74 C6.2
  Top 0.5: U$2.D1$2 51.02,13.75 arc-90 51.92,14.65 53.18,14.65 arc90 54.48,15.95 54.48,18.05 arc-45 54.93,19.13 55.44,19.64 | MAG_PWR.1 62.2,45.06 arc-45 63.73,41.36 63.73,19.5 arc-90 62.52,18.28 60.84,18.28 arc-90 59.36,19.77 59.36,20.55 arc90 58.09,21.81 57.1,21.81 arc90 56.07,20.77 56.07,20.45 R29.1
  Top 0.59: U$2.D1$1 U$2.D1$2
  Top 0.6: U$2.D1$1 49.76,9.74 C6.2
3V3_MC_EL  (via drill 0.45)  (4 unrouted)
  Top 0.305: 45.51,20.42 R12.1 45.24,20.05 45.24,20.02 | U$8.OUT 44.62,17.95 | 27.32,31.21 R4.2 27.32,31.49 27.58,31.49 | 29.65,29.91 29.79,29.91 R3.2 29.94,29.76 30.62,29.76 30.91,29.48 arc45 31.36,29.29 v31.54,29.29 | 14.31,32.13 U$1.VCC arc-90 16.18,30.37 v16.18,30.07 | 27.6,38.59 U$19.ENABLE | 29.27,36.54 29.66,36.15 29.77,36.15 R5.2 29.67,36.04 29.17,35.54 28.84,35.54 arc45 27.56,35.01 27.52,34.97 arc-45 26.82,34.68 23.65,34.68 arc-90 22.65,35.68 22.65,38.34 U$19.VIN 23.32,38.59 | 26.45,23.11 26.22,22.88 | U1.16 55.01,30.8 arc-45 54.91,30.58 54.76,30.43 arc-45 54.54,30.34 52.87,30.34 arc-45 52.65,30.43 52.51,30.56 arc-45 52.42,30.79 52.42,31.41 U1.12 v52.41,32.94 v52.4,32.94 | 48.23,39.48 49.38,38.34 arc-45 49.57,37.88 49.57,36.59 v49.55,36.56 | 39.26,38.21 39.26,37.57 U$4.28 | 57.37,29.22 R19.2 | v59.13,28.76 v59.13,28.77 | v56.92,5.2 56.62,4.89 arc-45 55.91,4.6 52.57,4.6 arc45 51.86,4.31 U$21.A
  Top 0.4: U$4.28 39.24,34.13 arc45 39.43,33.68 39.84,33.27 arc-45 40.03,32.82 U$4.7
  Top 0.406: U$17.17 38.45,7.56 38.74,7.27 arc45 39.44,6.98 39.99,6.98 arc45 40.69,7.27 41.02,7.6 arc45 41.31,8.3 41.31,10.2 arc-90 42.31,11.2 45.16,11.2 arc90 45.95,11.99 45.95,12.45 U$7.D1$2 | 39.26,38.21 arc-45 39.62,39.09 arc-45 40.38,39.4 40.87,39.4 arc45 42.46,40.06 42.92,40.52 arc-45 44.35,41.11 45.67,41.11 arc-45 47.06,40.54 48.03,39.57 R1.2
  Top 0.45: U$7.D1$2 45.95,13.2 45.95,16.43 arc90 45.62,16.76 44.95,16.76 arc-90 44.63,17.08 U$8.OUT 44.63,18.97 arc-45 44.95,19.73 45.24,20.02 | C12.2 arc-90 25.91,42.21 25.91,39.49 arc90 26.86,38.54 arc-90 26.9,38.59 U$19.ENABLE 27.57,38.59 arc-90 28.68,37.48 arc45 28.92,36.9 29.27,36.55 29.27,36.54 | C11.2 22.94,42.85 22.83,42.85 arc-45 21.89,43.24 20.89,44.24 arc45 20.44,44.43 U2.16 | R5.2 arc-45 30,36.04 | 29.79,29.91 arc45 28.49,30.45 28.41,30.45 arc-45 27.37,30.88 R4.2 27.27,31.44 | C5.2 14.29,32.15 14.31,32.13 | C7.2
  Top 0.5: U$7.D1$2 U$7.D1$1 | 45.95,13.2 47.22,13.2 | 45.95,12.45 47.22,12.45 | v59.13,28.77 R19.2
  Top 0.508: R4.2 27.09,31.16 | C2.1 48.33,23.79 | 46.51,23.79 C1.1 45.94,23.22 41.3,23.22 arc-45 40.28,23.64 arc-45 40.03,24.24 40.03,25.39 U$4.7 | U2.16 C7.2
  Top 0.6: R2.2 | R11.2
  Top 0.61: 48.58,23.54 C2.1 48.11,23.15 48.11,22.68 arc-90 45.58,20.15 R12.1 44.9,20.49 44.9,20.8 arc90 43.9,21.8 34.09,21.8 arc90 32.96,20.66 32.96,20.64 R18.2 | 48.07,23.43 48.21,23.29 | 45.31,20.12 45.24,20.05 | 11.84,32.11 11.43,32.1 | 11.86,32.15 arc-90 C5.2 | 19.22,47.49 arc45 19,48.03 arc45 17.16,48.79 15.14,48.79 arc45 13.18,47.98 arc45 12.34,45.95 12.34,32.61 C5.2 | 26.58,22.98 14.11,22.98 arc-45 11.46,24.07 11.25,24.29 arc-45 10.31,26.54 10.31,31.66 v10.33,31.68 10.33,31.71 10.42,31.8 arc-45 11.15,32.11 11.84,32.11 | 26.45,23.11 26.58,22.98 | 26.58,22.98 arc-90 26.68,22.88 | 11.84,32.11 C5.2 | R2.2 arc-23 29.69,23.05 29.67,23.05 arc-90 R2.2
  Top 0.8: 48.33,23.79 46.51,23.79 | R19.2 R20.2 | R8.1 R2.2 | R2.2 R11.2 | R11.2 R18.2
  Top 0.813: C2.1 48.35,23.39 48.3,23.39 | C11.2 C12.2
  Bottom 0.305: v49.55,36.56 arc45 50.09,35.25 v52.4,32.94 52.4,32.87 52.41,32.86 52.41,25.93 JP4.1 58.03,25.57 arc90 59.13,26.66 v59.13,28.76 | v16.18,30.07 16.38,30.07 16.39,30.06 29.57,30.06 arc-45 31.42,29.29 v31.54,29.29 | U$17.17 38.45,6.86 arc90 40.28,5.03 56.99,5.03 56.87,5.14 v56.92,5.2
  Bottom 0.406: 10.19,31.68 arc45 8.76,31.09 arc45 8.3,29.97 8.3,29.57 arc-45 7.86,28.51 6.89,27.54 PROGRAM.2
  Bottom 0.45: v10.33,31.68 10.19,31.68
3V3_MC_GNSS  (2 unrouted)
  Top 0.4: U$11.OUT 23.68,81.07 arc90 24.39,80.36 40.91,80.36 arc-90 43.66,77.61
  Top 0.45: U$11.OUT 23.68,82.55 arc90 23.35,82.88 22.49,82.88 arc-45 22.03,83.07 21.97,83.13 arc45 21.56,83.3 21.04,83.3 C9.2
  Top 0.5: U$10.D1$2 U$10.D1$1 21.75,85.02 arc-45 21.57,84.57 20.71,83.72 arc-90 C9.2
  Top 0.8: R16.1 C9.2
5V0  (via drill 0.45)  (2 unrouted)
  Top 0.305: U$14.IN 24.13,11.77 | 24.13,12.05 24.16,12.05
  Top 0.406: 24.13,11.76 24.13,11.77 24.13,12.05 | U$25.A 38.01,3.47
  Top 0.45: 24.14,11.33 U$14.IN 24.14,10.81 arc-90 23.88,10.56 23.74,10.56 arc90 23.48,10.31 U$14.GATEP | 26.74,11.97 R17.2 26.79,12.12 24.26,12.12 24.19,12.05
  Top 0.813: U$17.1 U$17.2 28.29,10.79 arc90 27.18,11.9 26.98,11.9 R17.2
  Bottom 0.305: v36.65,3.34 arc90 36.38,3.61 29.92,3.61 arc-90 28.29,5.24 U$17.1
5V0_MC_RPI  (via drill 0.45, 0.5)  (3 unrouted)
  Top 0.305: U$14.OUT 22.84,9.09 | 22.84,8.9 22.84,8.2 22.82,8.18 22.82,8.07 v22.84,8.05 | v39.2,2.3 39.4,2.3 40.2,3.1 40.37,3.1 U$24.A
  Top 0.45: U$14.OUT 22.84,10.13 arc90 22.38,10.58 21.77,10.58 arc-45 21.06,10.87 19.91,12.02
  Top 0.5: v19.91,12.77 19.91,12.02 | 20.84,11.1 20.84,11.13 20.3,11.13 C10.2 20.07,13.93 U$13.D1$1 20.89,13.88 v19.91,13.88 19.89,13.87 19.89,12.91 | 20.5,13.6 20.5,11.51
  Top 0.55: U$13.D1$1 U$13.D1$2 | 20.75,13.59 22,13.59
  Bottom 0.305: 23.36,2.37 23.31,2.37 | 23.31,2.37 23.26,2.42 arc-45 22.84,3.42 v22.84,8.05 | 23.31,2.37 23.38,2.3 v39.2,2.3
  Bottom 1: RPI.1 5.96,47.08 arc90 2.96,44.08 2.96,20.01 arc90 6.06,16.91 17.21,16.91 arc-90 19.91,14.21 v19.91,13.88 v19.91,12.77
7V0  (1 unrouted)
  Top 0.45: U$12.IN 17.68,10.78 17.48,10.78 arc90 17.02,10.33 U$12.GATEP 17.02,6.74 R27.2
  Top 0.6: R27.2 17.69,6.33
  Top 0.813: 17.69,6.33 17.69,6.18 arc90 18.69,5.18 28.36,5.18 arc90 29.56,6.38 29.56,7.81
  Bottom 0.813: U$17.3 U$17.5
7V0_MAG  (via drill 0.5)  (2 unrouted)
  Top 0.45: U$12.OUT 16.38,10.22 arc90 15.82,10.77 14.64,10.77 14.48,10.93 | 14.48,10.97 14.1,11.36 | 15.88,10.77 14.16,10.77
  Top 0.55: U$9.D1$2 U$9.D1$1 | 15.77,14.24 14.49,14.24 | 15.77,13.49 14.49,13.49 14.48,13.49
  Top 0.6: U$9.D1$1 14.5,12.75 14.72,12.53 v14.72,12.49
  Top 0.61: U$9.D1$1 14.49,13.49 | 14.48,13.49 14.48,10.97 14.48,10.93 | 14.1,11.36 13.78,11.36 C8.2
  Bottom 0.6: MAG_PWR.3 62.65,51.04 arc-90 65.24,48.45 65.24,3.88 arc-90 62.72,1.36 16.56,1.36 arc-90 14.73,3.19 v14.73,12.48 v14.72,12.49
CS_ADC  (via drill 0.45, 0.5)
  Top 0.305: 43.24,26.01 43.24,25.77 | 43.23,25.77 43.24,25.77 | 43.24,25.77 v44.17,25.77 | 43.23,25.77 43.23,25.68 | v27.32,27.66 27.32,25.44 27.23,25.22 R8.2 | U$4.11 43.23,25.77 | v21.68,27.68 18.47,27.68 arc-90 17.61,28.53 17.61,36.18 arc-90 18.27,36.84 19.2,36.84 U2.10
  Bottom 0.305: v44.17,25.77 44.12,25.82 arc45 42.75,26.39 31.99,26.39 arc-23 30.54,26.68 28.54,27.51 arc23 27.77,27.66 v27.32,27.66 21.7,27.66 v21.68,27.68
GND  (via drill 0.35, 0.45)  (5 unrouted)
  Top 0.2: 50.38,38.63 49.65,39.36 49.65,41.85 44.98,46.52 | v44.46,37.6 v44.47,37.6 R100.1
  Top 0.305: 27.63,39.88 U$19.GND_FORCE U$19.GND_SENSE | 27.63,39.88 28.35,39.88 arc90 28.6,40.14 28.6,40.35 arc-90 28.85,40.6 29.89,40.6 R21.1 | 40.58,44.45 40.87,44.16 41.22,43.33 arc-45 40.59,41.81 38.65,39.87 arc45 38.44,39.36 38.44,37.56 U$4.29 | U$8.GND 43.34,18.24 43.27,18.31 | v42.34,18.59 42.58,18.59 | U$12.GND 17.7,9.39 17.7,8.92 arc45 v18,8.2 | 27.03,39.23 27.03,39.88 | 27.63,39.23 27.63,39.88 | U$3.GND 53.62,7.28 | 54.25,6.65 v54.3,6.7
  Top 0.4: Q2.1 39.64,16.71 arc90 40.22,16.13 42.15,16.13 arc90 42.57,16.55 42.57,17.94 | 42.57,17.94 42.57,18.34 | 42.57,18.34 42.57,18.59 v42.34,18.59 | U$8.GND 42.57,17.94 | v42.34,18.59 | v42.34,18.59 42.31,18.59 | C1.2 46.3,26.34 47.33,26.34 47.44,26.45 47.44,26.84 47.87,27.28 | C10.1 20.44,9.75 20.54,9.65 22.08,9.65 22.08,9.52 U$14.ON | U$14.GND 24.71,9.41 v25.8,10.5 | U$11.GND 24.98,81.5 v25.8,81.5 | R10.2 48,15.95 48,16.1 | 43.34,18.34 42.57,18.34
  Top 0.406: U1.8 50.45,38.55 arc90 50.38,38.63 | C13.2 25.67,36.32 25.67,37.62 | 54.25,6.65 53.62,7.28
  Top 0.45: U$4.6 39.24,27.31 38.45,28.1 U$4.29 38.45,33.27 38.21,33.03 | 38.21,36.11 38.31,36.2
  Top 0.5: R10.2 47.92,15.55 48.26,15.55 arc-90 49.26,14.55 49.26,14.32 arc-45 49.02,13.74 48.95,13.67 arc45 48.75,13.21 48.75,11.81 arc-45 48.5,11.2 48.48,11.18 arc45 48.27,10.66 48.27,8 48.31,8.04 C6.1
  Bottom 0.25: R10.2 47.5,15.95 47.5,16.1
  other vias: 18.93,28.88 11.8,29.22 47.52,15.95 34,93 39,93 36.5,90.5 44,93 49,93 54,93 51.5,90.5 56.5,90.5 59,93 61.5,90.5 64,88 66.5,85.5 56.5,85.5 29,93 19,93 16.5,90.5 14,93 14,88 11.5,90.5 9,93 4,93 1.5,90.5 11.5,85.5 9,88 9,83 14,83 11.5,80.5 4,83 9,78 14,78 16.5,80.5 16.5,75.5 11.5,75.5 6.5,75.5 6.5,70.5 4,68 9,68 6.5,65.5 11.5,70.5 14,73 14,68 11.5,65.5 9,63 4,63 6.5,60.5 14,63 16.5,65.5 16.5,70.5 19,73 19,78 21.5,75.5 21.5,70.5 19,68 21.5,65.5 24,68 26.5,70.5 26.5,75.5 31.5,75.5 29,78 34,78 39,78 36.5,75.5 41.5,75.5 39,73 34,73 31.5,70.5 29,68 34,68 36.5,70.5 41.5,70.5 39,68 41.5,65.5 36.5,65.5 31.5,65.5 26.5,65.5 24,63 29,63 34,63 39,63 36.5,60.5 39,58 41.5,60.5 31.5,60.5 34,58 26.5,60.5 29,58 21.5,60.5 19,63 16.5,60.5 19,58 24,58 11.5,60.5 14,58 9,58 4,58 6.5,55.5 11.5,55.5 24,48 21.5,50.5 26.5,50.5 16.5,50.5 27,44.2 31.5,45.5 31.5,40.5 34,48 41.5,45.5 44,43 46.5,45.5 44,48 49,43 49,48 51.5,45.5 54,48 59,43 59.2,36.5 46.5,75.5 49,78 46.5,80.5 51.5,75.5 54,73 51.5,70.5 49,73 46.5,70.5 49,68 46.5,65.5 54,68 51.5,65.5 51.5,60.5 9,43 1.5,85.5 1.5,80.5 1.5,75.5 1.5,70.5 1.5,65.5 1.5,60.5 1.5,55.5 1.5,50.5 1.5,45.5 1.5,40.5 1.5,35.5 4,48 1.5,30.5 1.5,25.5 1.5,20.5 1.5,15.5 1.5,10.5 4,8 6.5,10.5 9,13 11.5,10.5 11.5,15.5 1.5,5.5 4,3 6.5,5.5 9,18.3 66.5,1.75 6.5,1.75 1.5,1.75 60.9,16.9 60.9,9.2 56.1,30.5 56.5,39.25 58.8,31.75 53.95,33.2 41.35,27.8 38.65,27.8 48.55,26.5 47.15,26.5 48.65,19.4 55.7,18.3 57.8,23.2 54,24.3 53.5,19.7 63.5,16.9 38.8,19.9 42.3,36 30.9,6.3 20.9,6.8 13.4,5.3 11.5,20.8 4.5,28 4.5,23 4.5,33 4.5,43 9,38 9,48 31.5,48 38.75,39.8 61.5,75.5 56.95,52.8 56.95,55.3 63.7,58 63.7,63 63.7,68 63.7,73 63.7,53 61.2,55.5 61.4,33.45 27.9,21.5 24.8,21.5 21.68,24.33 12.4,25.12 16.3,46.8 16.3,40.5 20.83,28.88 17.6,41.9 33.93,24.58 31.73,27.68 19.98,24.33 25.8,6.9 42.75,58 10.95,45.6 43.15,29.8 37.45,29.8 48.4,6.85 49.5,6.85 27.2,36.4 25.9,37.6 56.9,17.4 30.9,4.8 27.6,41.9 41.5,48 20.6,89.3 38.7,17.4 38,16.6 39.4,20.5 58.4,2.85 59.3,4.15 23.4,45.3 25.7,45.3 17.5,45.5 47.85,27.4 66.8,6.95
  pour Top: -3.57,2.53 -3.57,95.52 -0.6,98.49 54.78,98.49 71.29,81.98 71.29,1.73 66.43,-3.13 2.09,-3.13
  pour Bottom (no thermals): -2.1,2.16 -2.1,94.28 0.73,97.11 56.56,97.11 69.8,83.87 69.8,0.99 66.39,-2.42 2.48,-2.42
INDI
  Top 0.305: 36.04,38.18 arc90 34.96,39.26 32.85,39.26 arc-90 U$18.A | U$4.32 36.04,38.18 | 36.04,38.18
INT<<MAG
  Top 0.305: U$4.9 41.63,25.33 arc45 41.99,24.46 42.13,24.32 arc45 43.12,23.91 43.75,23.91 arc90 45.02,25.18 45.02,26.42 arc-90 45.7,27.1 45.95,27.1 arc90 46.58,27.73 46.58,27.86 arc-90 47.16,28.44 53.19,28.44 arc-90 54.12,27.5 54.12,26.82 arc90 56.41,24.53 58.17,24.53 arc-45 59.98,23.78 COM_MAG.2
INT<<MAIN  (via drill 0.45)
  Top 0.305: v41.09,24.27 41.13,24.31 arc-45 40.84,25.02 U$4.8 | v34.38,20.65 34.41,20.62 34.41,17.86 arc-45 33.67,16.07 33.11,15.53 R22.2 30.83,13.15 U$17.6
  Bottom 0.305: v41.09,24.27 arc45 39.06,25.11 36.85,25.11 arc45 35.52,24.56 arc45 34.35,21.73 34.35,20.68 v34.38,20.65
INT<<RPI  (via drill 0.4)
  Top 0.305: U$4.10 | v43.24,24.67 42.95,24.67 arc-45 42.68,24.78 arc-45 42.44,25.35 U$4.10 | v18.24,20.7 17.72,21.22 arc45 15.4,22.18 13.86,22.18 arc-90 9.35,26.68 9.35,31.44 arc-45 10.12,33.3 10.54,33.73 arc45 11.34,35.65 11.34,42.68 arc90 9.57,44.45 6.79,44.45 RPI.2
  Bottom 0.305: v43.24,24.67 43.24,24.73 43.02,24.95 arc45 41.06,25.76 23.49,25.76 | 23.49,25.76 23.42,25.69 | 23.49,25.76 20.74,25.76 arc90 18.24,23.26 v18.24,20.7
INT>>MAIN  (via drill 0.45)
  Top 0.305: v37.64,24.26 37.62,24.26 37.62,25.99 37.64,26.01 U$4.4
  Bottom 0.305: v37.64,24.26 37.64,19.84 arc-90 35.27,17.47 35.23,17.47 arc90 34.3,16.54 34.3,15.45 arc45 34.9,14 35.95,12.95 arc-45 37.18,9.99 U$17.16
MC_SPI_CLK
  Top 0.305: U$4.37 32.84,33.41 arc-45 31.94,33.78 32.09,33.63 arc45 30.86,34.14 R5.1 29.84,34.18 28.45,34.18 arc45 27.56,33.81 27.66,33.91 arc-45 26.43,33.41 U$1.C 23.01,33.41 arc-45 22.34,33.68 arc-45 21.97,34.59 21.97,36.95 arc45 20.6,40.24 arc45 19.91,40.53 19.82,40.62 U2.13
MC_SPI_MISO
  Top 0.305: U$1.DQ1 16.04,24.52 arc90 17.04,25.52 17.04,38.02 arc-90 18.37,39.35 U2.12 19.68,39.35 19.68,39.35 arc-45 20.51,39.01 arc-45 21.36,36.95 21.36,34.34 arc45 21.83,33.2 21.99,33.04 arc45 22.62,32.78 28,32.78 arc-45 29.18,32.29 29.74,31.73 R3.1 30.21,31.73 32.16,29.78 arc45 33.05,29.41 33.49,29.41 U$4.42
MC_SPI_MOSI
  Top 0.2: U$4.43 33.4,28.51 33.34,28.51
  Top 0.305: 33.34,28.51 28.9,28.51 arc-45 27.36,29.15 27.2,29.31 R4.1 26.95,29.31 25.83,30.43 arc-45 25.56,31.08 25.56,31.43 arc45 25.39,31.84 arc45 24.68,32.13 U$1.DQ0 22.78,32.13 arc-45 21.41,32.71 arc-45 20.75,34.29 20.75,36.88 arc45 20.38,37.77 arc45 19.64,38.08 19.63,38.09 U2.11
MCLR_MAG
  Bottom 0.305: U$22.19 37.6,90.06 arc-45 39.02,90.65 47.65,90.65 arc-45 49.07,90.06 58.12,81.02 arc-45 59.98,76.51 59.98,71.73 arc45 60.57,70.31 PANEL.5
MCLR_MC  (via drill 0.45)
  Top 0.305: v46.89,32.58 46.89,32.61 46.88,32.6 U$4.18 44.29,32.6 44.28,32.61 arc-90 43.47,33.42 43.47,35.74 arc-90 44.21,36.48 46.55,36.48 arc45 47.19,36.75 47.99,37.55 arc45 47.99,37.56 R1.1
  Bottom 0.305: U$17.19 39.71,6.78 arc90 40.8,5.68 42.36,5.68 arc90 44,7.32 44,10.21 arc-90 45.03,11.24 48.51,11.24 arc90 51.42,14.15 51.42,27.87 arc45 50.06,31.16 49.21,32.01 arc45 47.8,32.59 v46.9,32.59 v46.89,32.58 46.91,32.6 46.72,32.6 46.73,32.59 9.12,32.59 arc65 7.2,31.36 6.7,30.28 PROGRAM.1
N$2
  Top 0.305: U$21.C R23.2
N$3
  Top 0.305: U$4.30 37.64,40.28 arc-45 37.93,40.99 Y1.2 38.69,43.74 arc-45 38.4,44.44 C3.1
N$4
  Top 0.305: R24.2 U$23.C
N$5
  Top 0.305: U$4.31 36.85,40.28 arc45 36.56,40.98 Y1.1 35.8,43.74 arc45 36.09,44.44 C4.1
N$6
  Top 0.305: R25.2 U$24.C
N$7
  Top 0.305: R26.2 U$25.C
N$8  (via drill 0.45)
  Top 0.305: U$1.S# 16.23,25.79 v16.25,25.8 | v28.11,26.67 28.13,26.68 arc-90 29.56,25.25 29.56,25.06 R2.1 29.68,24.71 29.98,24.38 arc-45 31.48,23.76 31.9,23.34 arc45 33.74,22.58 37.2,22.58 arc90 38.44,23.82 38.44,26.06 U$4.5
  Bottom 0.305: v28.11,26.67 19.93,26.67 arc22 16.86,26.06 v16.26,25.81 arc45 v16.25,25.8
N$9
  Top 0.254: R26.1 35.11,1.37
  Top 0.305: 53.89,1.54 R23.1 53.6,1.7 53.44,1.7 52.97,1.23 arc-45 52.02,0.84 47.02,0.84 arc-45 46.08,1.23 45.77,1.54 R24.1 R25.1 42.92,1.3 arc-45 41.71,0.8 36.89,0.8 arc-45 35.41,1.41 R26.1 34.94,1.3 13.46,1.3 arc-45 12.04,1.89 IND.1
N$10
  Top 0.5: U$2.S2 53.55,16.27 arc-90 52.77,15.48 51.81,15.48 arc-90 51.02,16.27 U$2.S1
N$11  (1 unrouted)
  Top 0.45: U$3.SENSE 52.98,10.88 53.56,11.29 U$2.D2$2
  Top 0.55: U$2.D2$2 52.53,12.6 | U$2.D2$1 52.59,12.3 52.59,12.12
  Top 0.6: U$2.D2$2 53.76,12.6 arc-90 54.76,11.6 54.76,9.5 arc135 55.38,9.25 55.62,9.49 R6.1
N$12  (via drill 0.5)
  Top 0.305: Q5.2 58.3,14.89 v58.1,14.89 | U$2.G2 v52.3,16.34 v52.29,16.34
  Top 0.45: U$3.GATE 52.33,10.77 v51.94,11.15
  Top 0.5: U$2.G1 49.76,18.57 arc-90 50.35,19.17 51.73,19.17 arc-90 52.3,18.6 U$2.G2
  Bottom 0.305: v58.1,14.89 58.1,12.64 arc-90 56.61,11.15 v51.94,11.15 51.94,12.52 arc-15 51.97,12.78 52.12,13.31 arc15 52.15,13.57 52.15,16 arc-45 v52.29,16.34 52.29,16.37
N$13
  Top 0.6: Q6.2 Q5.3 55.7,11.45 arc90 56.33,10.81 57.2,10.81 arc-90 57.84,10.18 57.84,9.49 R28.2
N$14
  Top 0.5: U$9.S1 15.77,18.25 arc90 16.4,17.61 17.67,17.61 arc90 18.3,18.25 U$9.S2
  pour Top (no thermals): 15.7,20.1 15.95,20.1 arc-90 16.2,19.85 16.2,18.9 16.2,18.35 arc90 16.45,18.1 17.1,18.1 17.65,18.1 arc90 17.9,18.35 17.9,18.7 17.9,19.85 arc-90 18.15,20.1 18.2,20.1 18.45,20.1 arc-90 18.7,19.85 18.7,19.3 18.7,17.73 arc-90 18.07,17.1 17.7,17.1 16.04,17.1 arc-90 15.4,17.73 15.4,18.7 15.4,19.85 arc-90 15.65,20.1
N$15
  Top 0.305: U$18.C 31.89,37.68 arc-45 30.47,38.27 30.06,38.68 R21.2
N$16
  Top 0.305: 17.04,11.82 U$12.SENSE
  Top 0.45: U$9.D2$1 17.04,11.82
  Top 0.5: R27.1 19.15,8.28 arc45 18.96,8.73 18.81,8.88 arc-45 18.62,9.33 18.62,12.7 arc45 18.33,13.4 18.3,13.43 U$9.D2$2
  Top 0.55: U$9.D2$1 U$9.D2$2
  pour Top (no thermals): 18.7,14.3 18.7,14.85 arc90 18.45,15.1 16.9,15.1 arc90 16.7,14.9 16.7,14.1 16.7,13.25 arc90 16.95,13 17.3,13 18.45,13 arc90 18.7,13.25
N$17
  Top 0.305: U$9.G1 14.49,17.93 arc45 14.79,17.22 16.09,15.92 arc-45 16.38,15.22 16.38,11.81 U$12.GATE
  Top 0.5: U$9.G1 14.49,19.91 arc-90 15.15,20.56 16.34,20.56 arc-90 17.04,19.86 U$9.G2
N$18
  Top 0.5: R29.2 57.87,20.55 58.24,20.55 58.24,16.52 Q6.3
N$19
  Top 0.305: U$7.S2 43.41,7.14 | 45.95,7.21 U$7.S1
  Top 0.5: U$7.S2 43.41,8.41 arc-90 43.95,8.96 45.4,8.96 arc-90 45.95,8.41 U$7.S1
  pour Top (no thermals): 43.9,8.06 43.9,6.95 arc-90 43.65,6.7 43.25,6.7 arc-90 43,6.95 43,8.3 43,9.5 arc-90 44,10.5 45.6,10.5 arc-90 46.6,9.5 46.6,7.5 46.6,7.05 arc-90 46.35,6.8 45.8,6.8 45.75,6.8 arc-90 45.5,7.05 45.5,7.9 45.5,8.06 arc90 44.87,8.7 44.8,8.7 44.53,8.7 arc90
N$20
  Top 0.305: U$7.D2$1 44.67,13.62 44.19,14.11 arc-45 44,14.56 44,15.55 U$8.SENSE | 41.4,12.87 R9.1
  Top 0.5: U$7.D2$1 U$7.D2$2 41.4,12.87
  pour Top (no thermals): 40.3,13.9 43.48,13.9 arc90 43.8,14.22 43.8,15.2 44.2,15.2 44.2,14.63 arc45 44.8,13.8 44.8,13.8 45.01,13.59 arc-45 45.1,13.37 45.1,12.22 arc-90 44.78,11.9 40.62,11.9 arc-90 40.3,12.22
N$22  (via drill 0.45)
  Top 0.305: U$8.GATE 44.65,15.55 44.65,14.97 arc45 44.81,14.59 45.1,14.29 v45.13,14.29 | U$7.G1 arc45 47.22,8.26 | U$7.G1 47.22,8.19 | 44.67,8.22 U$7.G2 44.8,7.49 44.8,6.96 arc90 45.32,6.44 46.62,6.44 arc90 47.09,6.91 47.09,7.49 U$7.G1 | v47.92,14.26 47.92,12.04 arc-45 47.68,11.47 47.43,11.21 arc45 47.22,10.69 U$7.G1 | Q1.2 35.93,14.47 v35.99,14.41
  Bottom 0.305: v35.99,14.41 35.99,14.31 45.05,14.31 45.07,14.29 v45.13,14.29 45.15,14.27 47.86,14.27 47.86,14.26 arc90 v47.92,14.26
N$24
  Top 0.406: 11.2 38.02,15.1 arc-90 36.88,16.34 Q1.3 36.88,17.9 arc-90 37.51,18.53 40.88,18.53 arc-90 41.54,17.87 Q2.2
N$26
  Top 0.5: R12.2 40.59,20.15 Q2.3 40.61,19.85 40.61,19.67 43.46,19.67
  Top 0.813: R12.2 43.17,19.98
N$28
  Top 0.5: U$10.S1 23.02,92.53 arc-90 23.66,93.17 24.93,93.17 arc-90 25.57,92.53 U$10.S2
N$29
  Top 0.45: U$11.SENSE 24.34,86.55 U$10.D2$1
  Top 0.5: U$10.D2$1 U$10.D2$2 26.16,86.58 arc-90 26.92,85.82 26.92,83.83 R14.1
N$30  (via drill 0.35, 0.4)
  Top 0.305: 24.3,92.31 U$10.G2 | 24.3,92.39 U$10.G2 | U$10.G1 21.75,90.8 arc90 22.39,90.16 v24.31,90.16 | v24.31,90.16 24.3,90.16 U$10.G2 | Q3.2 27.77,90.16 v24.31,90.16
  Top 0.4: 24.3,91.44 U$10.G2 24.3,91.38 | 21.75,91.34 U$10.G1
  Top 0.45: U$11.GATE 23.68,85.2 v23.61,85.28
  Bottom 0.305: v24.31,90.16 24.23,90.08 arc45 23.64,88.66 23.64,85.3 v23.62,85.28 v23.61,85.28
N$33
  Top 0.45: Q3.3 Q4.2 29.73,88.24 arc90 29.1,87.61 29.1,83.28 29.56,83.28 R15.2
  Top 0.5: R15.2 29.95,83.83
N$34
  Top 0.45: R16.2 19.97,87.26 arc-45 21.76,88 26.39,88 arc-45 27.34,87.61 27.66,87.29 Q4.3
N$36
  Top 0.5: U$13.S1 22.2,18.05 arc90 22.63,17.62 24.13,17.62 arc90 24.77,18.25 24.77,19.14
  Top 0.508: U$13.S1 22.16,19.14 | 24.77,19.14 U$13.S2
  pour Top (no thermals): 22.85,18.1 24.05,18.1 arc90 24.3,18.35 24.3,19.85 arc-90 24.55,20.1 24.95,20.1 arc-90 25.2,19.85 25.2,17.73 arc-90 24.57,17.1 22.43,17.1 arc-90 21.8,17.73 21.8,19.85 arc-90 22.05,20.1 22.35,20.1 arc-90 22.6,19.85 22.6,18.35 arc90
N$37
  Top 0.305: U$13.D2$1 23.48,13.9 U$14.SENSE
  Top 0.406: 23.52,13.98 23.48,13.94 | U$13.D2$2 24.83,14.02
  Top 0.45: U$13.D2$1 23.52,13.98
  Top 0.5: 24.73,13.96 U$13.D2$2
  Top 0.55: U$13.D2$2 U$13.D2$1
  Top 0.6: R17.1 26.79,13.86 24.73,13.96
  pour Top (no thermals): 27.6,14.1 27.6,15.08 arc90 27.28,15.4 26.4,15.4 23.52,15.4 arc90 23.2,15.08 23.2,14.5 23.2,13.6 arc90 23.5,13.3 23.5,13.1 23.6,13.1 23.6,13.2 27.6,13.2
N$38
  Top 0.305: 22.84,11.77 U$14.GATE 22.84,11.77 22.84,14.87 arc90 22.2,15.5 21.56,15.5 arc-90 20.93,16.14 U$13.G1 20.93,19.73
  Top 0.5: U$13.G2 23.46,20.09 arc90 22.83,20.73 21.56,20.73 arc90 20.93,20.09 U$13.G1
OUT0_ADC  (via drill 0.5)
  Top 0.6: U2.1 13.88,44.44 13.7,44.61 v13.7,45.74
  Bottom 0.5: v13.7,45.74 13.7,47.66 arc90 11.7,49.66 5.87,49.66 arc-90 2.66,52.87 2.66,83.73 arc-45 3.72,86.29 U$26.1
  Bottom 0.6: v13.7,45.74 13.7,45.69
PGC_MAG
  Bottom 0.305: U$22.13 39.24,87.89 arc-45 40.66,88.48 46.74,88.48 arc-45 48.16,87.89 56.41,79.64 arc-45 58.03,75.73 58.03,63.02 arc45 58.7,61.4 60.24,59.86 arc45 PANEL.1
PGC_MC  (via drill 0.45)
  Top 0.305: v46.88,30.97 v46.87,30.98 45.02,30.98 U$4.16 | v42.26,7.5 42.3,7.46 42.3,6.79 arc-90 41.27,5.76 36.88,5.76 arc-67 35.02,7 34.65,7.89 arc45 U$17.11
  Bottom 0.305: 13.79,30.97 v46.88,30.97 arc-45 48.6,30.26 48.62,30.25 arc-45 49.96,27 49.96,14.25 arc-90 48.28,12.57 44.64,12.57 arc90 42.27,10.2 v42.27,7.51 v42.26,7.5 | 13.79,30.97 | 13.79,30.97 arc90 9.71,26.89 9.71,22.96 arc-90 6.7,19.95 PROGRAM.5
PGD_MAG
  Bottom 0.305: U$22.15 38.67,88.59 arc-45 40.09,89.18 47.08,89.18 arc-45 48.5,88.59 56.95,80.14 arc-45 58.7,75.91 58.7,63.06 arc90 59.8,61.96 PANEL.2
PGD_MC  (via drill 0.45)
  Top 0.305: v47.91,31.77 47.89,31.79 45,31.79 U$4.17 | v41.37,6.64 41.35,6.64 arc-45 40.6,6.33 37.64,6.33 arc-68 36.14,7.33 36.02,7.62 35.91,7.73 arc45 U$17.13
  Bottom 0.305: v41.37,6.64 42.27,6.64 arc90 43.16,7.53 43.16,10.3 arc-90 44.74,11.88 48.27,11.88 arc90 50.68,14.29 50.68,27.66 arc45 49.45,30.63 48.93,31.15 arc22 48.12,31.69 47.92,31.77 arc45 v47.91,31.77 13.22,31.77 arc90 8.96,27.51 8.96,24.73 arc-90 PROGRAM.4
RESET_MAG
  Bottom 0.305: U$17.15 37.18,6.98 arc90 39.84,4.32 56.25,4.32 arc90 59.66,7.73 59.66,17.74 arc-45 60.04,18.66 COM_MAG.1
RESET_MAG_EXT  (via drill 0.45)
  Top 0.305: U$3.ON 51.67,6.93 | U$4.35 32.6,35.01 arc-45 31.9,35.3 v31.76,35.44 | 57.23,6.32 57.17,6.38 v57.2,6.38 57.54,6.04 arc-45 57.8,5.41 57.8,4.92 arc-90 56.68,3.8 56.29,3.8 R7.1
  Top 0.406: 51.67,6.93 51.32,6.58 v50.73,6.58
  Bottom 0.305: v50.73,6.58 51.08,6.23 arc45 52.49,5.64 55.42,5.64 arc45 v57.2,6.38 58.36,7.54 arc45 58.95,8.95 58.95,23.26 arc-45 59.54,24.68 arc45 59.96,25.7 59.96,31.38 arc45 59.06,33.55 55.62,36.99 arc45 53.81,37.74 48.81,37.74 arc45 46.29,36.7 45.39,35.8 arc-45 43.44,34.99 32.62,34.99 arc-45 31.92,35.28 v31.76,35.44
RESET_MC_EL  (via drill 0.45)  (2 unrouted)
  Top 0.305: R10.1 v48.81,17.65 47.61,17.65 47.61,19.62 arc-45 47.9,20.32 50.24,22.66 arc-45 51.14,23.03 JP4.2 | U$8.ON 47.33,17.94 47.52,17.75 R10.1 | R10.1 47.62,17.75 47.62,18.09 | 45.28,17.64 47.27,17.64 | 45.28,18.14 47.27,18.14
  Bottom 0.305: v48.81,17.65 48.81,17.6 arc-90 49.25,17.16 49.25,14.26 arc-90 48.25,13.26 43.13,13.26 arc45 39.49,11.75 arc45 38.45,9.24 U$17.18
RESET_MC_GNSS  (via drill 0.45, 0.5)
  Top 0.4: U$4.24 42.44,38.81 v42.66,39.03
  Top 0.45: 23.04,81.22 U$11.ON 23.04,79.16 R13.1 v24.38,79.16
  Bottom 0.305: v42.66,39.03 arc-90 42.66,39.1 43.07,39.51 arc-45 44.59,40.14 48.84,40.14 arc45 50.8,40.95 57.31,47.46 arc45 58.05,49.25 58.05,56.57 arc45 57.32,58.34 56.76,58.9 arc-45 56.03,60.67 56.03,75.38 arc45 55.09,77.65 49.34,83.4 arc45 47.69,84.08 30.13,84.08 arc45 29.57,83.85 25.12,79.41 arc-45 24.53,79.16 v24.38,79.16
RPI_EPS_IO_1
  Top 0.305: U$22.1 59.37,87.1 arc-45 60.79,86.51 65.2,82.1 arc-45 66.3,79.45 66.3,11.05 arc-45 65.06,8.06 64.69,7.69 arc-23 63.12,6.64 61.74,6.07 arc45 U$20.1
RPI_EPS_IO_2
  Top 0.305: U$20.2 61.53,3.53 65.76,7.76 arc45 67,10.75 67,79.75 arc45 65.83,82.57 61.33,87.07 arc45 59.33,87.9 49.63,87.9 arc-45 48.73,88.27 48.67,88.33 arc45 47.77,88.7 46.43,88.7 arc45 45.53,88.33 45.15,87.95 arc45 U$22.3
RX_GNSS  (via drill 0.45)  (1 unrouted)
  Top 0.305: U$4.44 34.56,27.82 arc45 35.01,28.01 35.42,28.42 arc45 35.61,28.87 35.61,34.43 arc45 35.05,35.78 v35.01,35.82
  Bottom 0.305: v35.01,35.82 arc90 33.99,36.84 30.9,36.84 arc-90 28.93,38.81 28.93,48.11 arc-90 31.43,50.61 53.66,50.61 arc90 55,51.95 55,56.21 arc90 53.39,57.82 47.41,57.82
RX_MC_TX_MAG
  Top 0.305: U$4.14 44.99,29.41 48.03,29.41 arc-10 48.92,29.33 49.81,29.17 arc10 50.59,29.1 53.69,29.1 arc-90 54.77,28.02 arc45 54.93,27.64 56.05,26.52 R20.1 56.12,26.23 57.04,25.31 arc45 57.49,25.12 58.32,25.12 arc90 59.36,26.16 59.36,26.83 arc-90 60.07,27.54 COM_MAG.4
RX_MC_TX_MAIN  (via drill 0.45)
  Top 0.305: v36.8,23.42 36.8,25.97 36.85,26.02 U$4.3
  Top 0.508: v32.47,17.15 R18.1
  Bottom 0.305: v36.8,23.42 36.8,20.4 arc-90 34.8,18.4 33.51,18.4 arc90 32.47,17.36 v32.47,17.15 32.47,16.23 arc45 33.1,14.7 34.78,13.02 arc-45 35.91,10.3 U$17.14
RX_MC_TX_RPI  (via drill 0.45)
  Top 0.305: U$4.19 47.88,33.41 v47.91,33.4
  Bottom 0.305: 47.89,33.41 v47.91,33.4 8.03,33.4 arc-90 5.22,36.21 5.22,37.13 arc-45 5.81,38.55 6.7,39.44 RPI.4
SELECT  (via drill 0.45)
  Top 0.152: U$4.23 43.23,38.1 43.24,38.1
  Top 0.305: v53.28,38.89 arc45 53.05,38.35 U1.4 | 43.24,38.1 43.98,38.84 arc-45 44.11,38.89 44.11,38.95 v44.12,38.96 44.16,38.92 45.22,38.92 45.71,39.41 R100.2
  Bottom 0.305: v44.12,38.96 arc-45 44.29,38.89 51.15,38.89 | v53.28,38.89 51.15,38.89 | 51.15,38.89 arc-45 51.15,38.89
TRCLK>>COM  (via drill 0.45)
  Top 0.305: U1.2 54.35,38.95 arc45 v53.98,39.85
  Bottom 0.305: v53.98,39.85 53.95,39.85 arc-45 55.38,43.3 57.94,45.86 arc45 59.41,49.41 59.41,58.73 arc45 58.68,60.5 58.08,61.1 arc-45 57.35,62.87 57.35,75.54 arc45 55.9,79.05 49.85,85.1 arc45 48.08,85.83 U$22.2
TRCLK_MC
  Top 0.305: U$4.21 52.44,35.01 arc91 53.7,36.3 U1.3
TRCLK_RPI
  Top 0.305: U$16.1 60.12,35.55 arc-45 59.22,35.18 56.27,35.18 arc-90 55.01,36.45 U1.1
TRDAT>>COM  (via drill 0.45)
  Top 0.305: U1.6 51.76,38.54 arc45 51.29,39.66 51.29,39.7 v51.23,39.76
  Bottom 0.305: U$22.4 44.8,85.57 45.24,85.13 arc45 45.86,84.87 47.96,84.87 arc-45 49.73,84.14 55.5,78.37 arc-45 56.69,75.5 56.69,61.8 arc45 57.42,60.03 58.02,59.43 arc-45 58.75,57.66 58.75,49.39 arc-45 57.59,46.6 51.57,40.58 arc45 v51.23,39.76
TRDAT_MC
  Top 0.305: U1.7 51.09,37.28 51.09,36.55 arc-90 50.34,35.8 U$4.22
TRDAT_RPI
  Top 0.305: U1.5 52.41,39.48 arc-90 53.67,40.75 59.3,40.75 arc-90 61.3,38.75 U$16.2
TX_GNSS  (via drill 0.45)  (1 unrouted)
  Top 0.2: J1.5 42.59,60
  Top 0.305: U$4.1 35.25,27.08 arc-45 35.44,27.53 35.82,27.91 arc45 36.21,28.85 v36.21,35.93
  Bottom 0.305: v36.21,35.93 36.21,36.45 arc90 34.44,38.22 30.95,38.22 arc-90 29.7,39.47 29.7,47.84 arc-90 31.77,49.91 53.72,49.91 arc90 55.75,51.94 55.75,56.31 arc90 53.52,58.54 47.9,58.54
TX_MC_RX_MAG
  Top 0.305: U$4.15 48.15,30.21 arc-12 49.23,30.09 50.29,29.86 arc12 51.37,29.74 54.71,29.74 arc-45 55.51,29.41 56.12,28.8 R19.1 56.12,28.91 57.1,29.89 arc-45 57.55,30.08 COM_MAG.5
TX_MC_RX_MAIN  (via drill 0.45)
  Top 0.305: v35.68,23.44 arc45 36.05,24.33 U$4.2
  Top 0.508: v29.69,17.15 R11.1
  Bottom 0.305: v35.68,23.44 35.76,23.36 35.76,23.17 arc-45 35.97,22.66 35.97,20.55 arc-90 34.97,19.55 33.08,19.55 arc45 31.22,18.78 29.69,17.25 v29.69,17.15 29.69,17.01 33.96,12.74 arc-45 34.64,11.09 U$17.12 34.93,9.46
TX_MC_RX_RPI  (via drill 0.45)
  Top 0.305: U$4.20 46.82,34.2 v46.89,34.21
  Bottom 0.305: v46.89,34.21 8.7,34.21 arc-90 6.7,36.21 RPI.5
VDD_MAG
  Bottom 0.305: U$22.17 38.1,89.29 arc-45 39.52,89.88 47.4,89.88 arc-45 48.82,89.29 57.56,80.55 arc-45 59.33,76.28 59.33,69.84 arc45 59.92,68.42 PANEL.4
VREF_2V5
  Top 0.305: C13.1 24.28,36.37
  Top 0.45: 24.28,36.37 24.28,38.41 arc90 23.45,39.23 U$19.VOUT_SENSE 22.88,39.24 22.88,39.88 U$19.VOUT_FORCE 22.27,39.88 arc-90 21.29,40.87 21.29,42.16 arc90 20.29,43.16 U2.15

### Text on the board
tNames: +X | RESET | 5V0 | MC | YOTSUBA_MC_ver.2.3
bNames: ADC IN | -X | TML:MAG | PWR:MAG | PWR/COM:RPI | TR:RPI | TML:MC | COM:MAG | PS:RPI